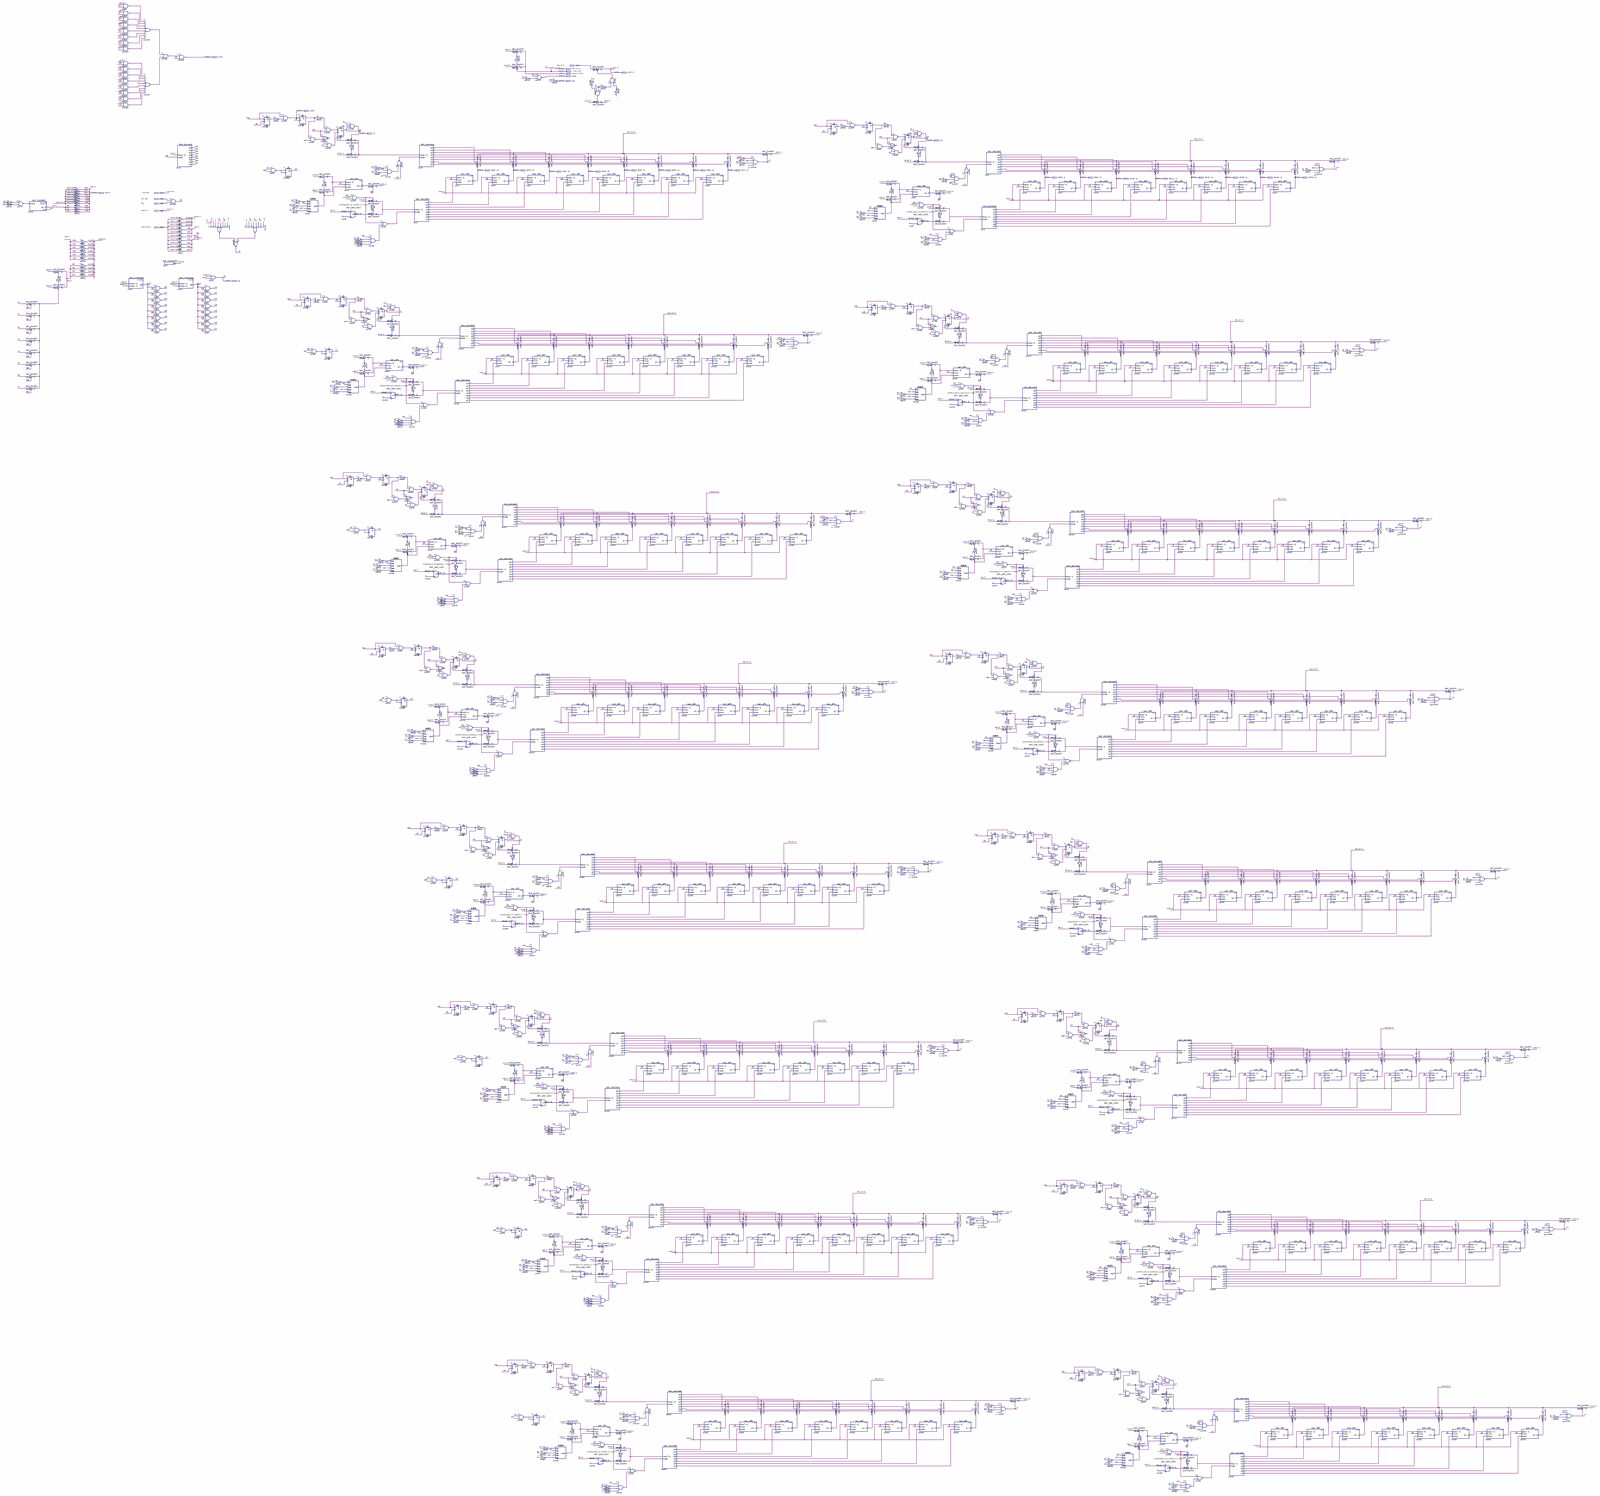
[diagram p0: schematic sheet, whole]
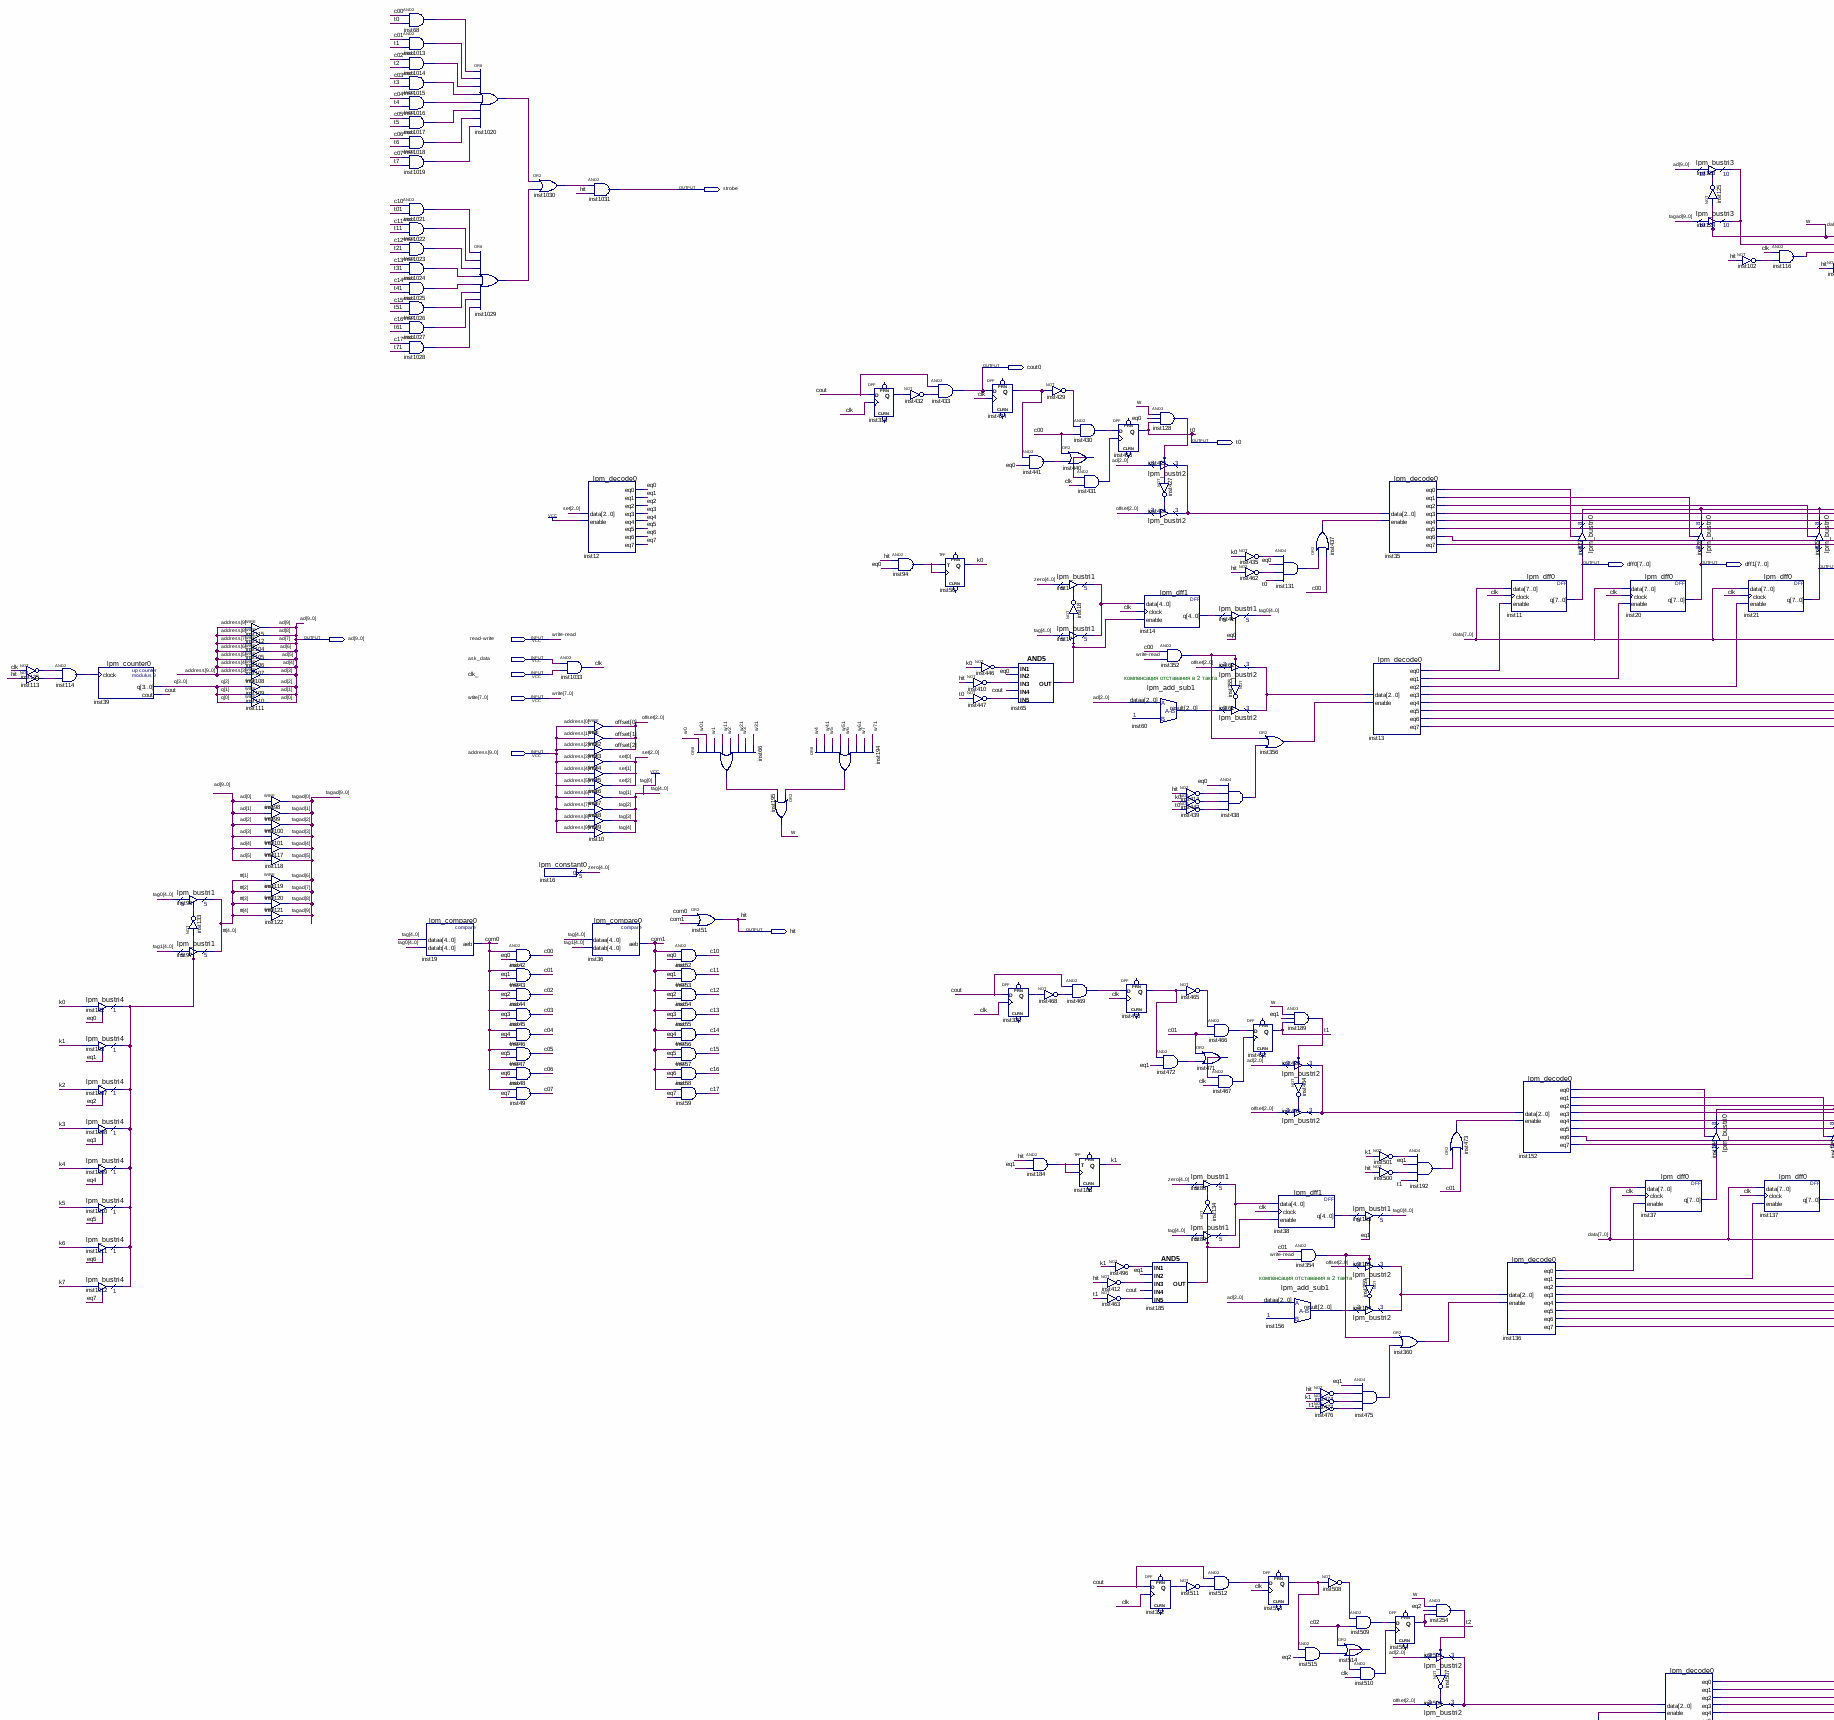
[diagram p1: schematic sheet, upper left part]
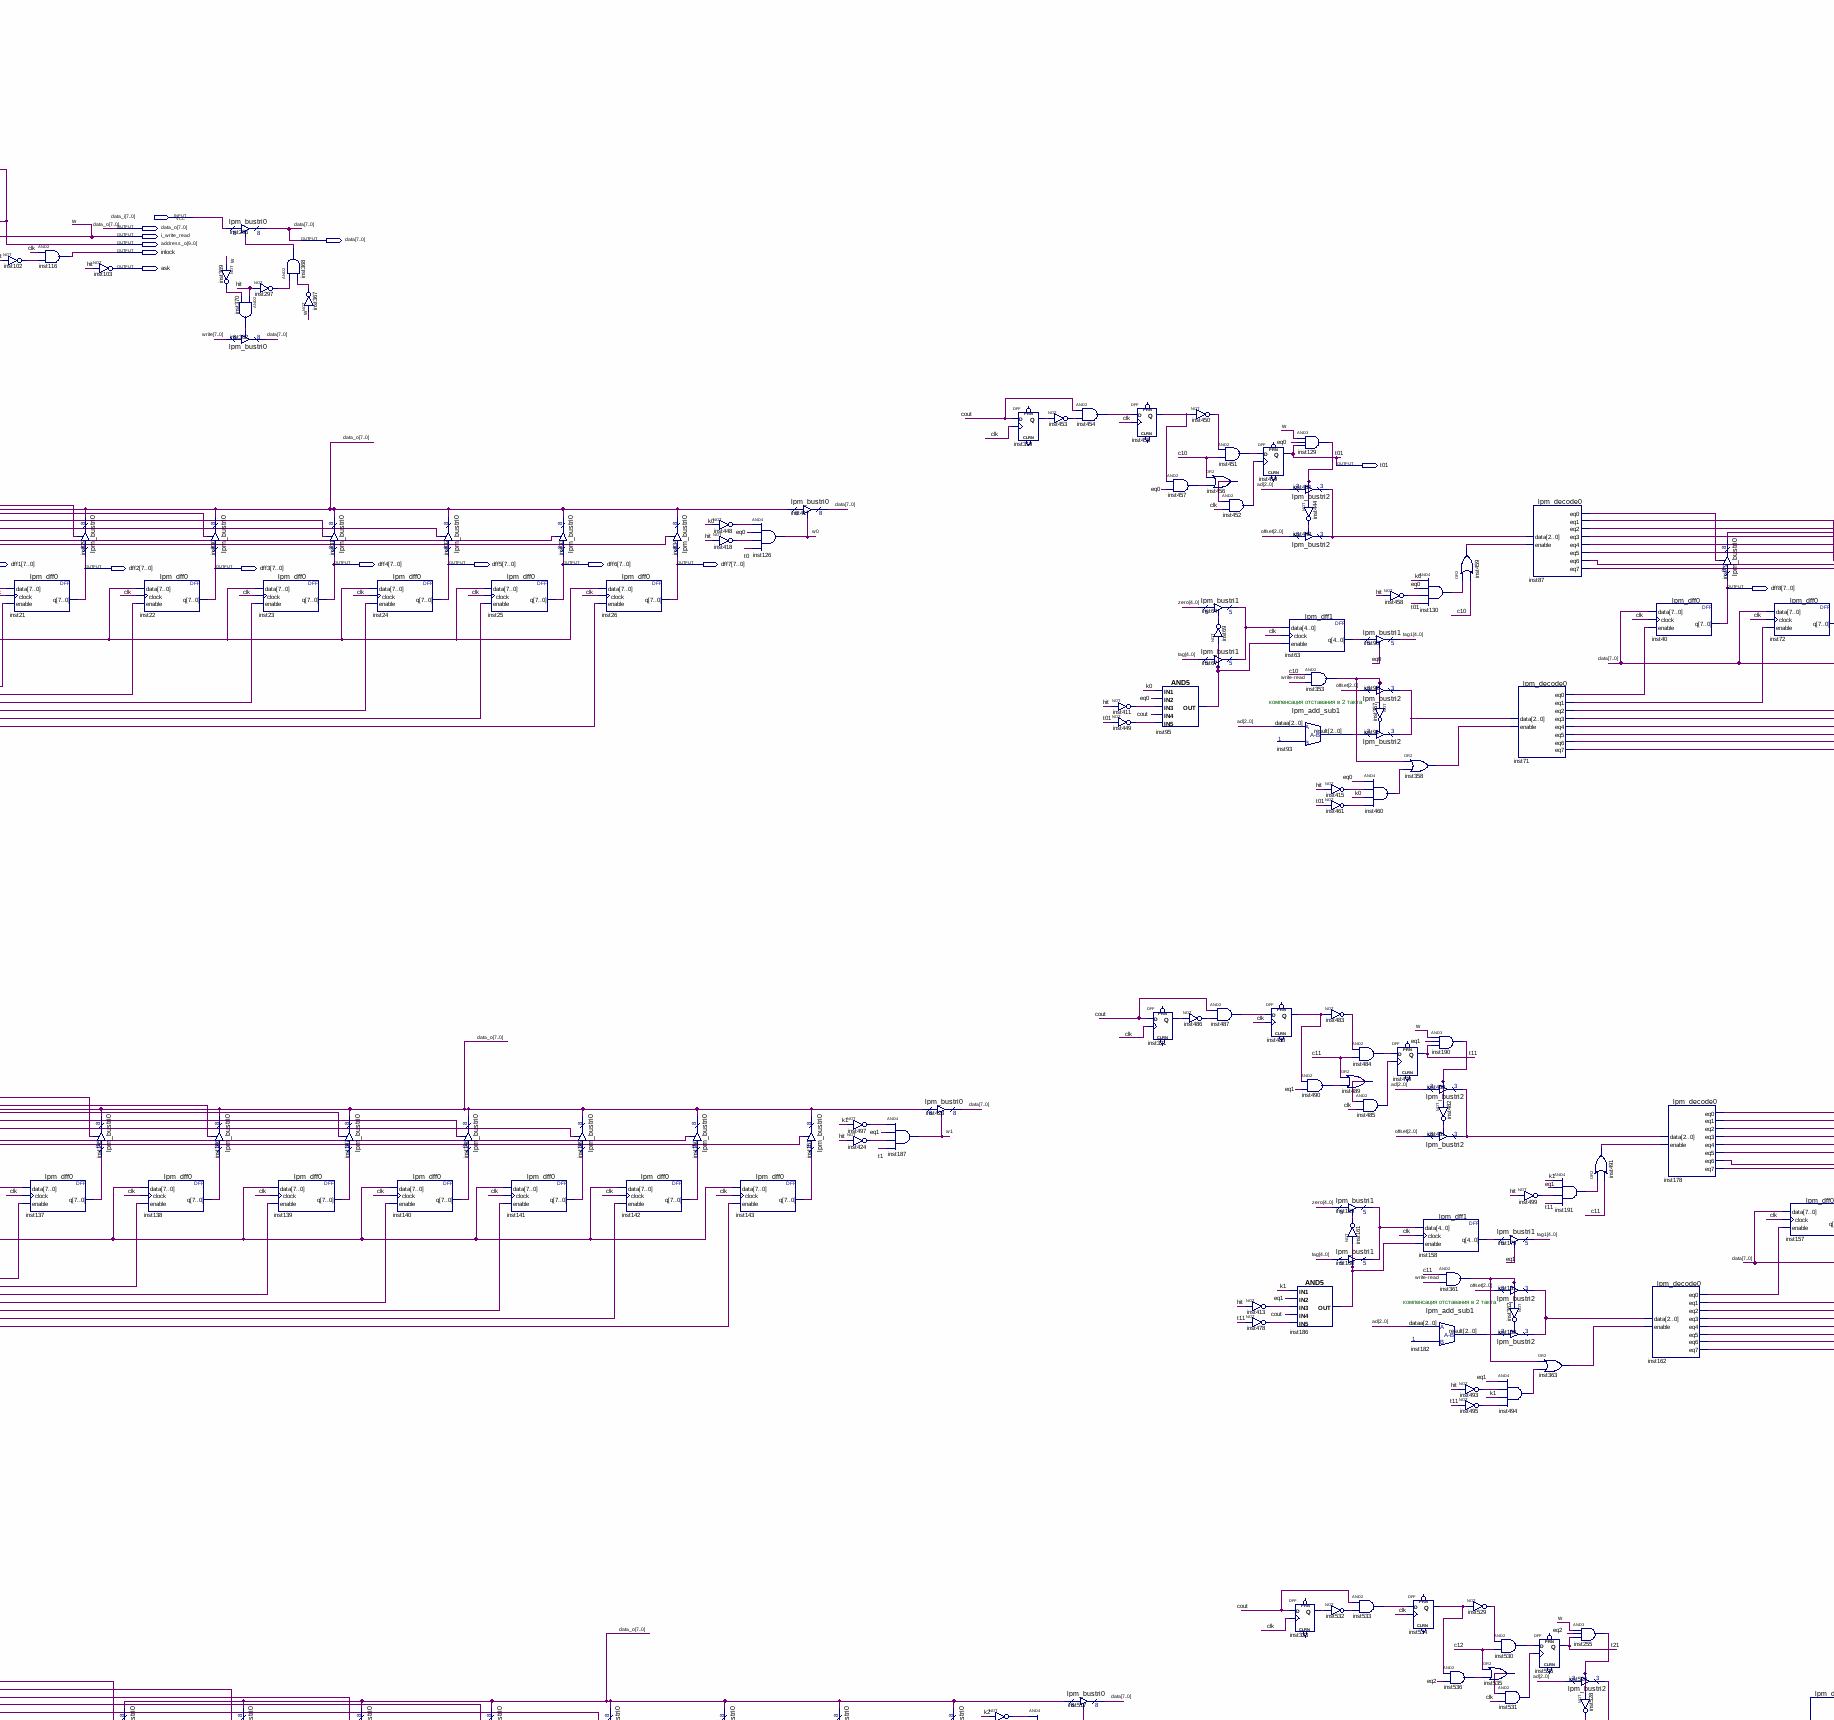
[diagram p2: schematic sheet, upper centre part]
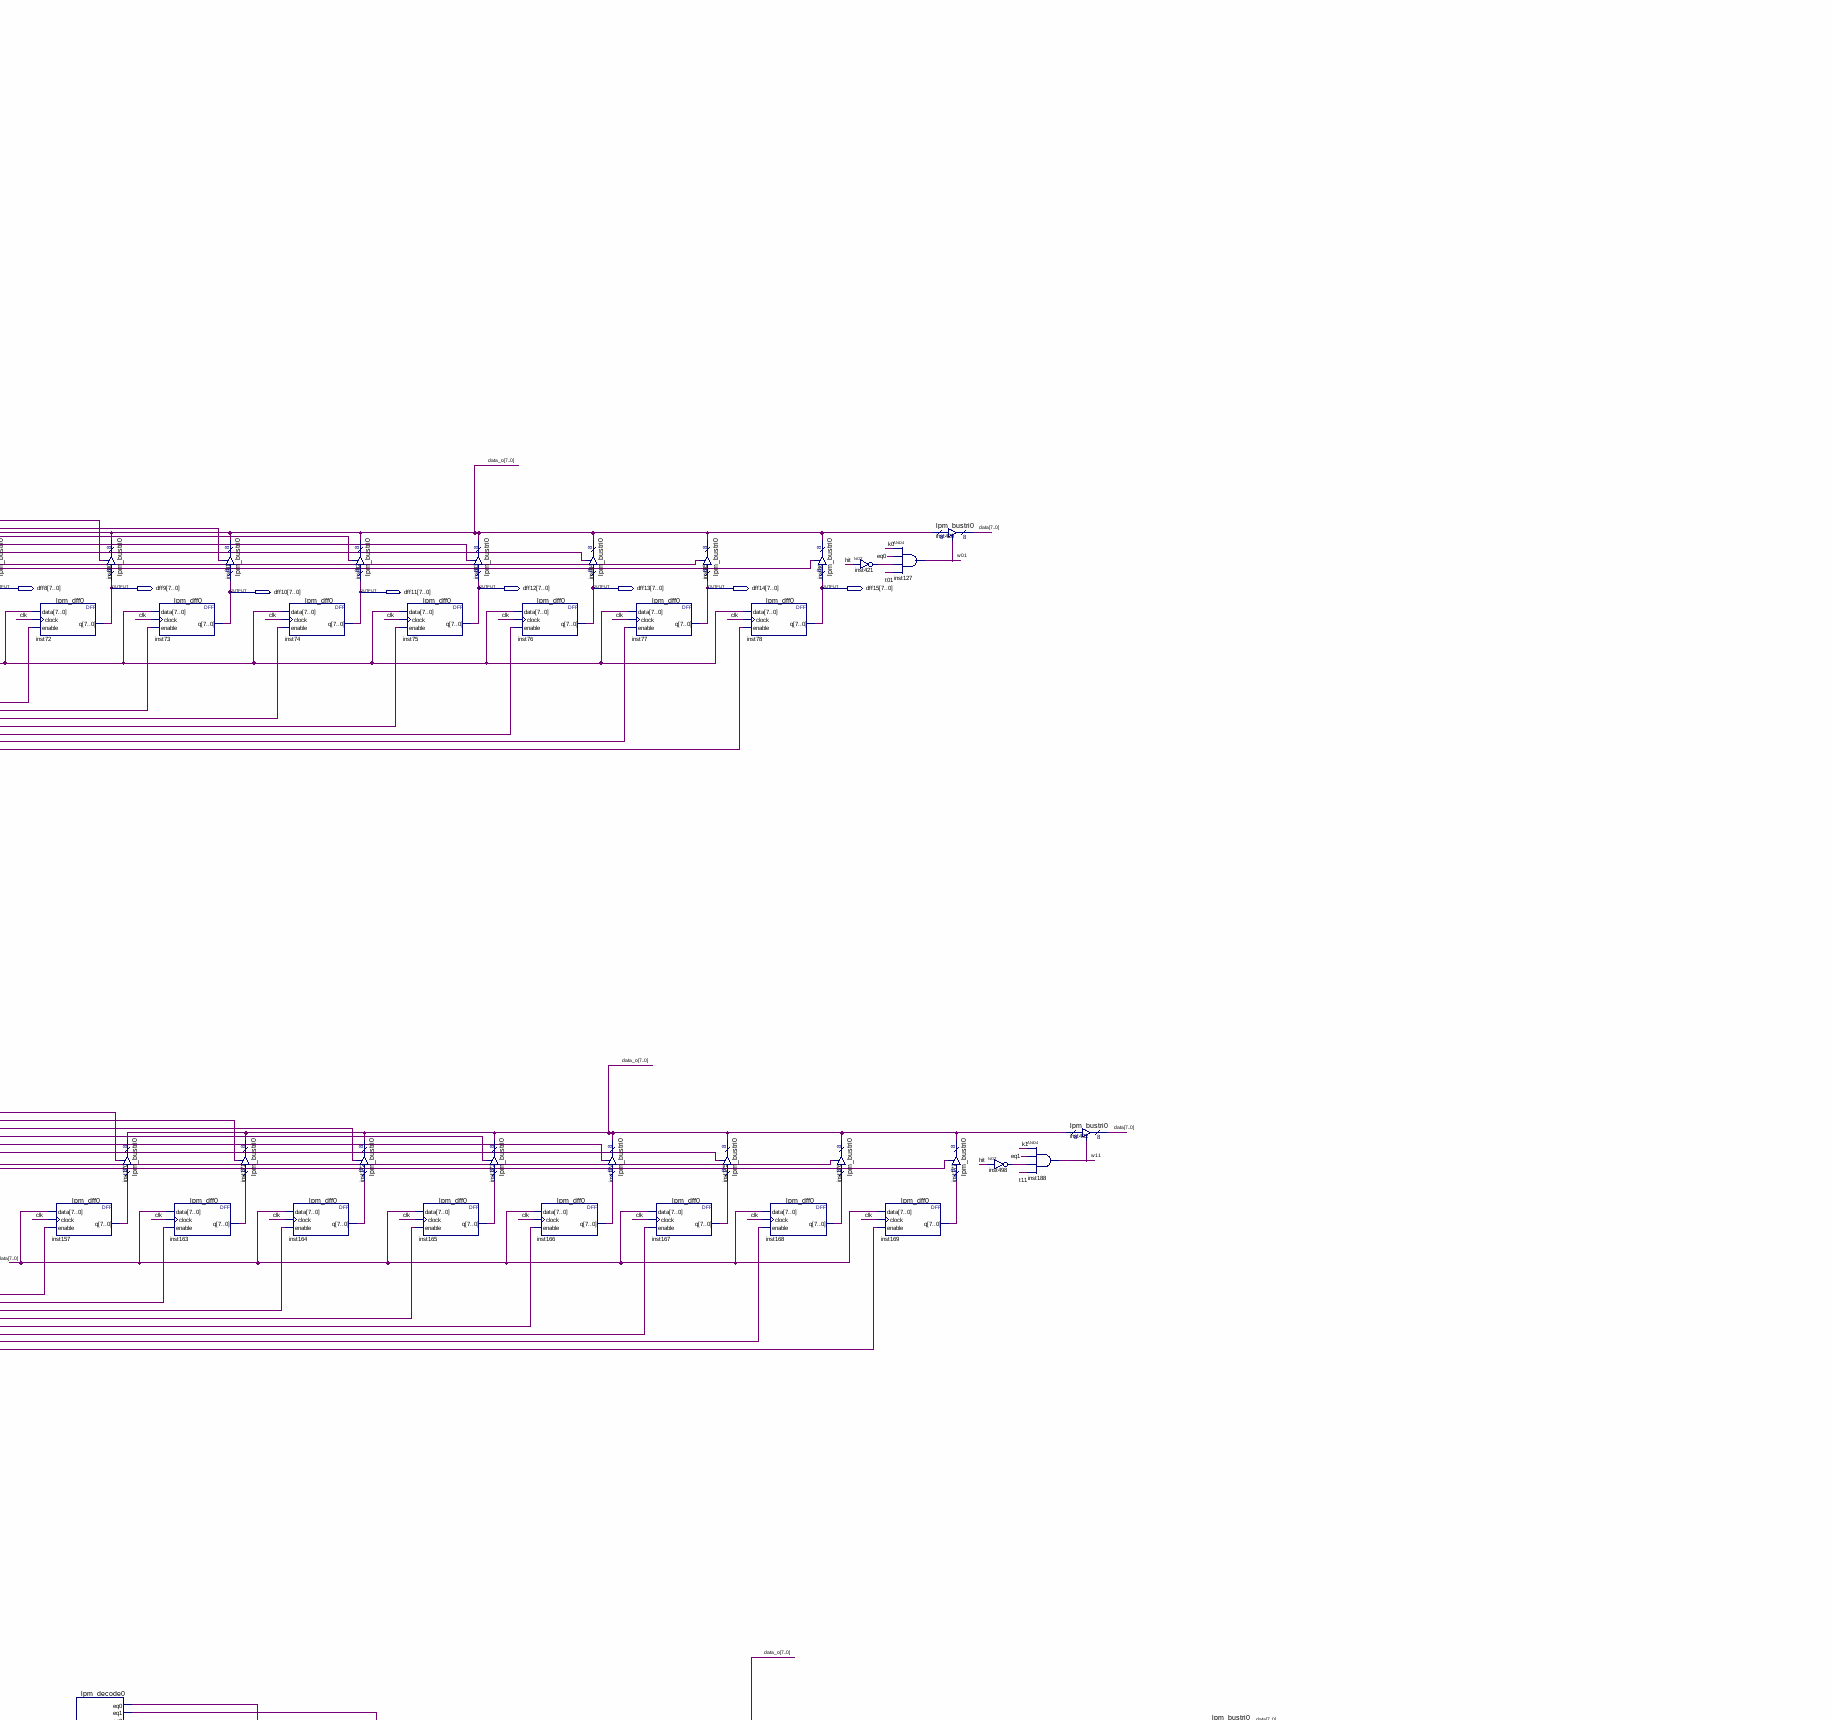
[diagram p3: schematic sheet, upper right part]
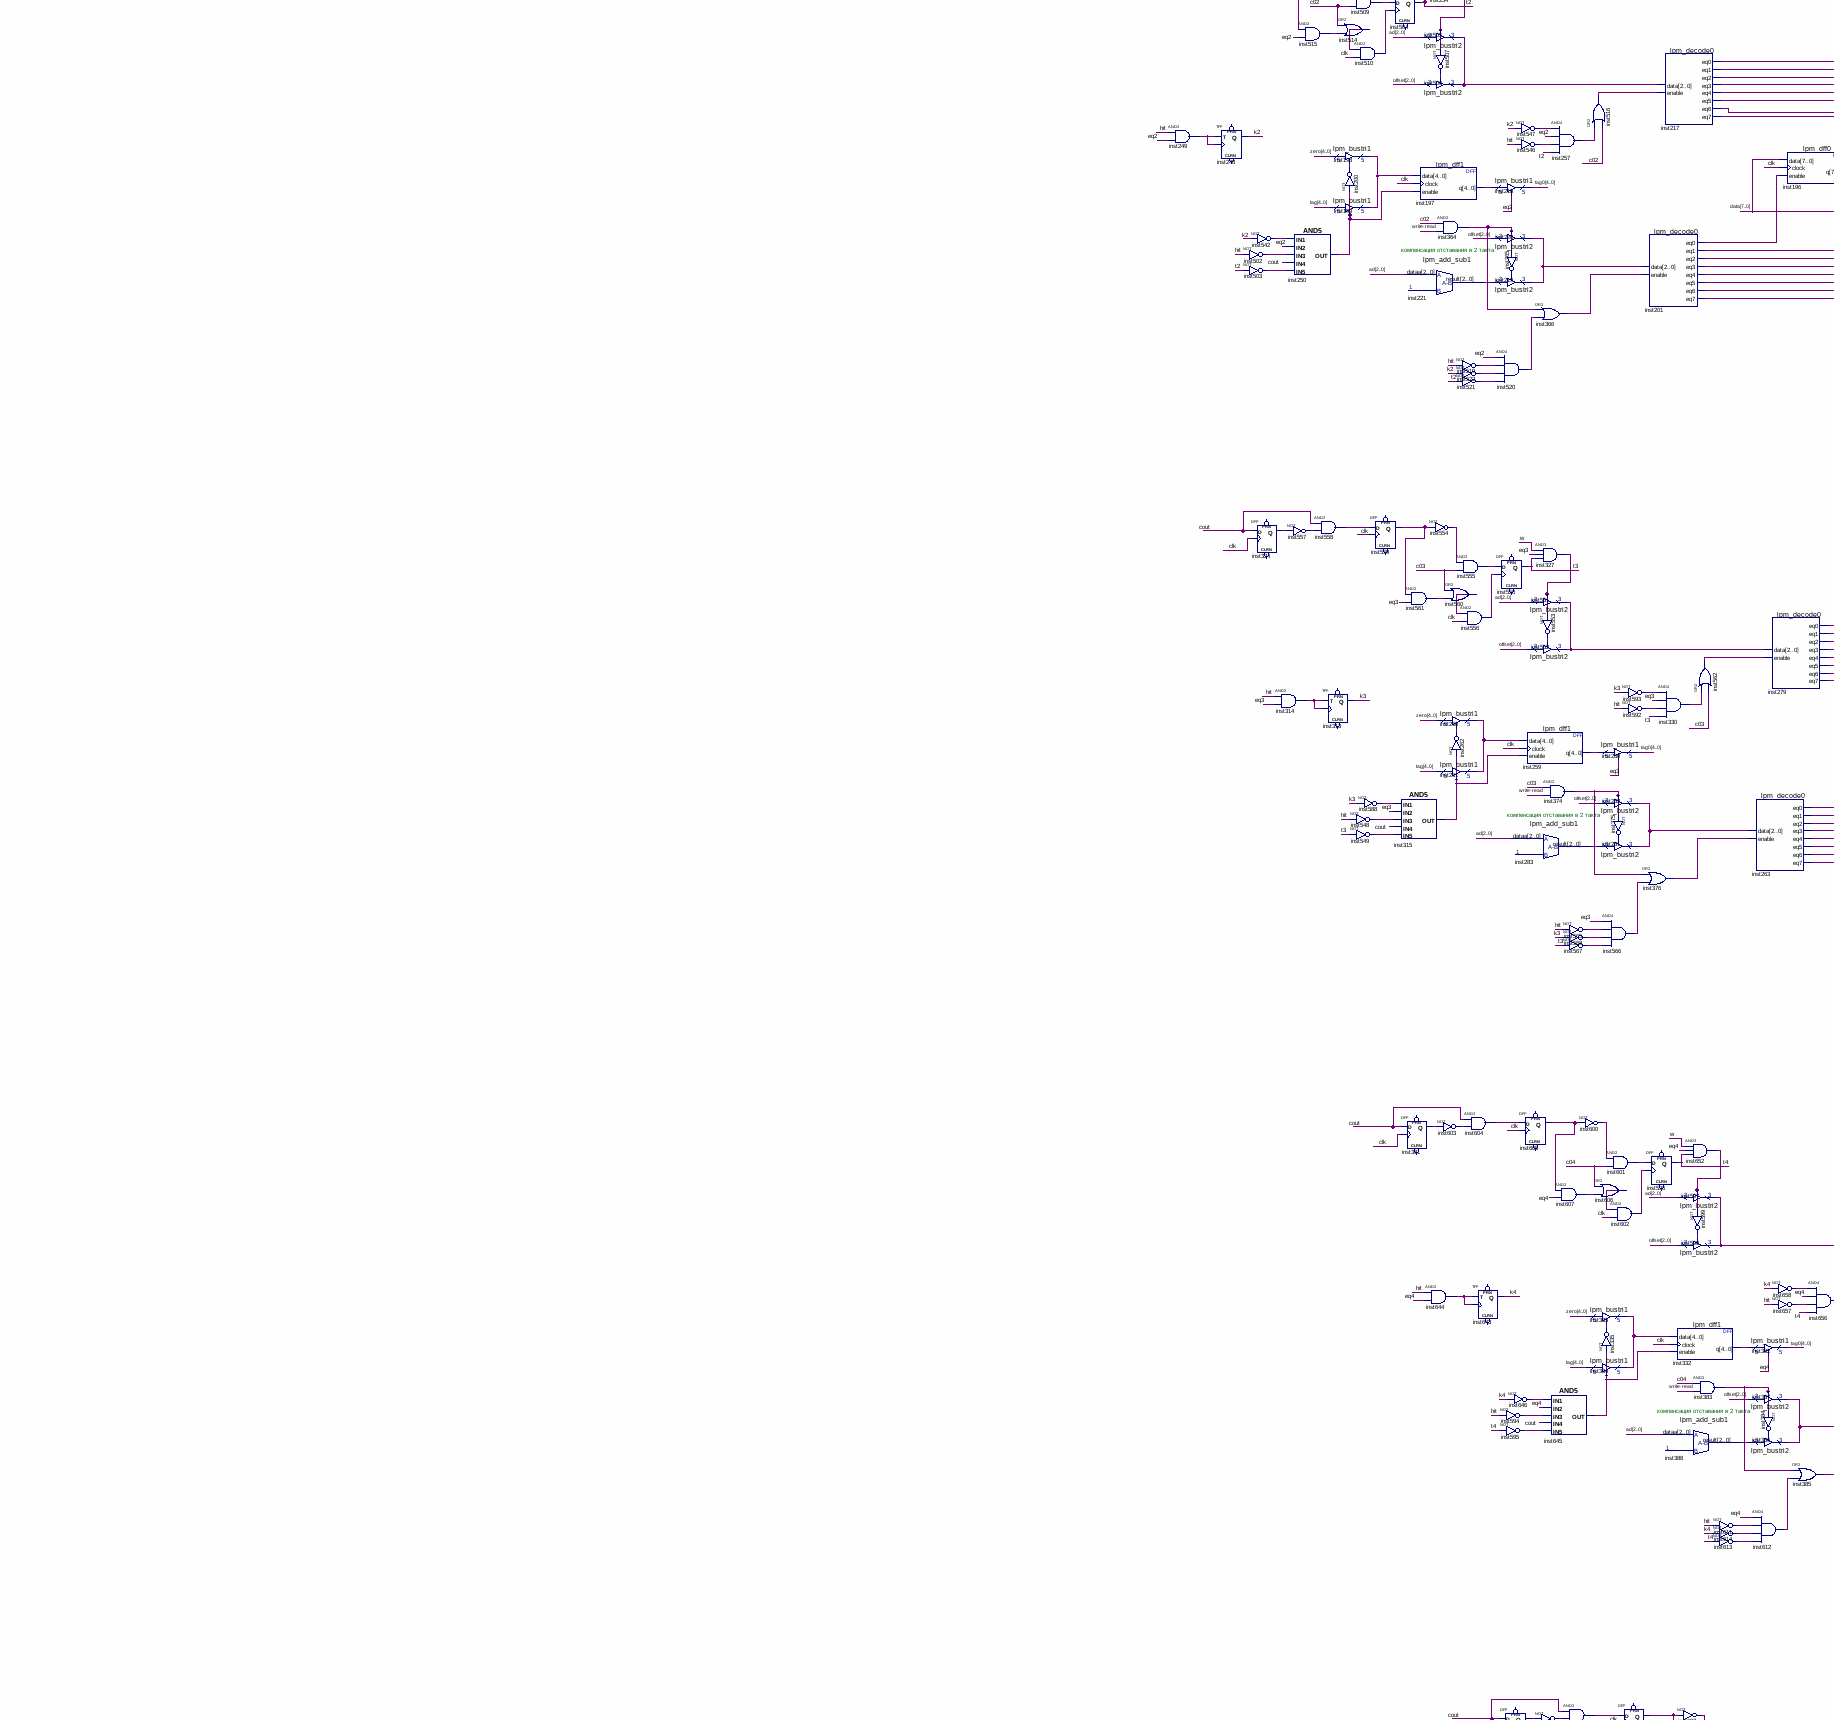
[diagram p4: schematic sheet, middle left part]
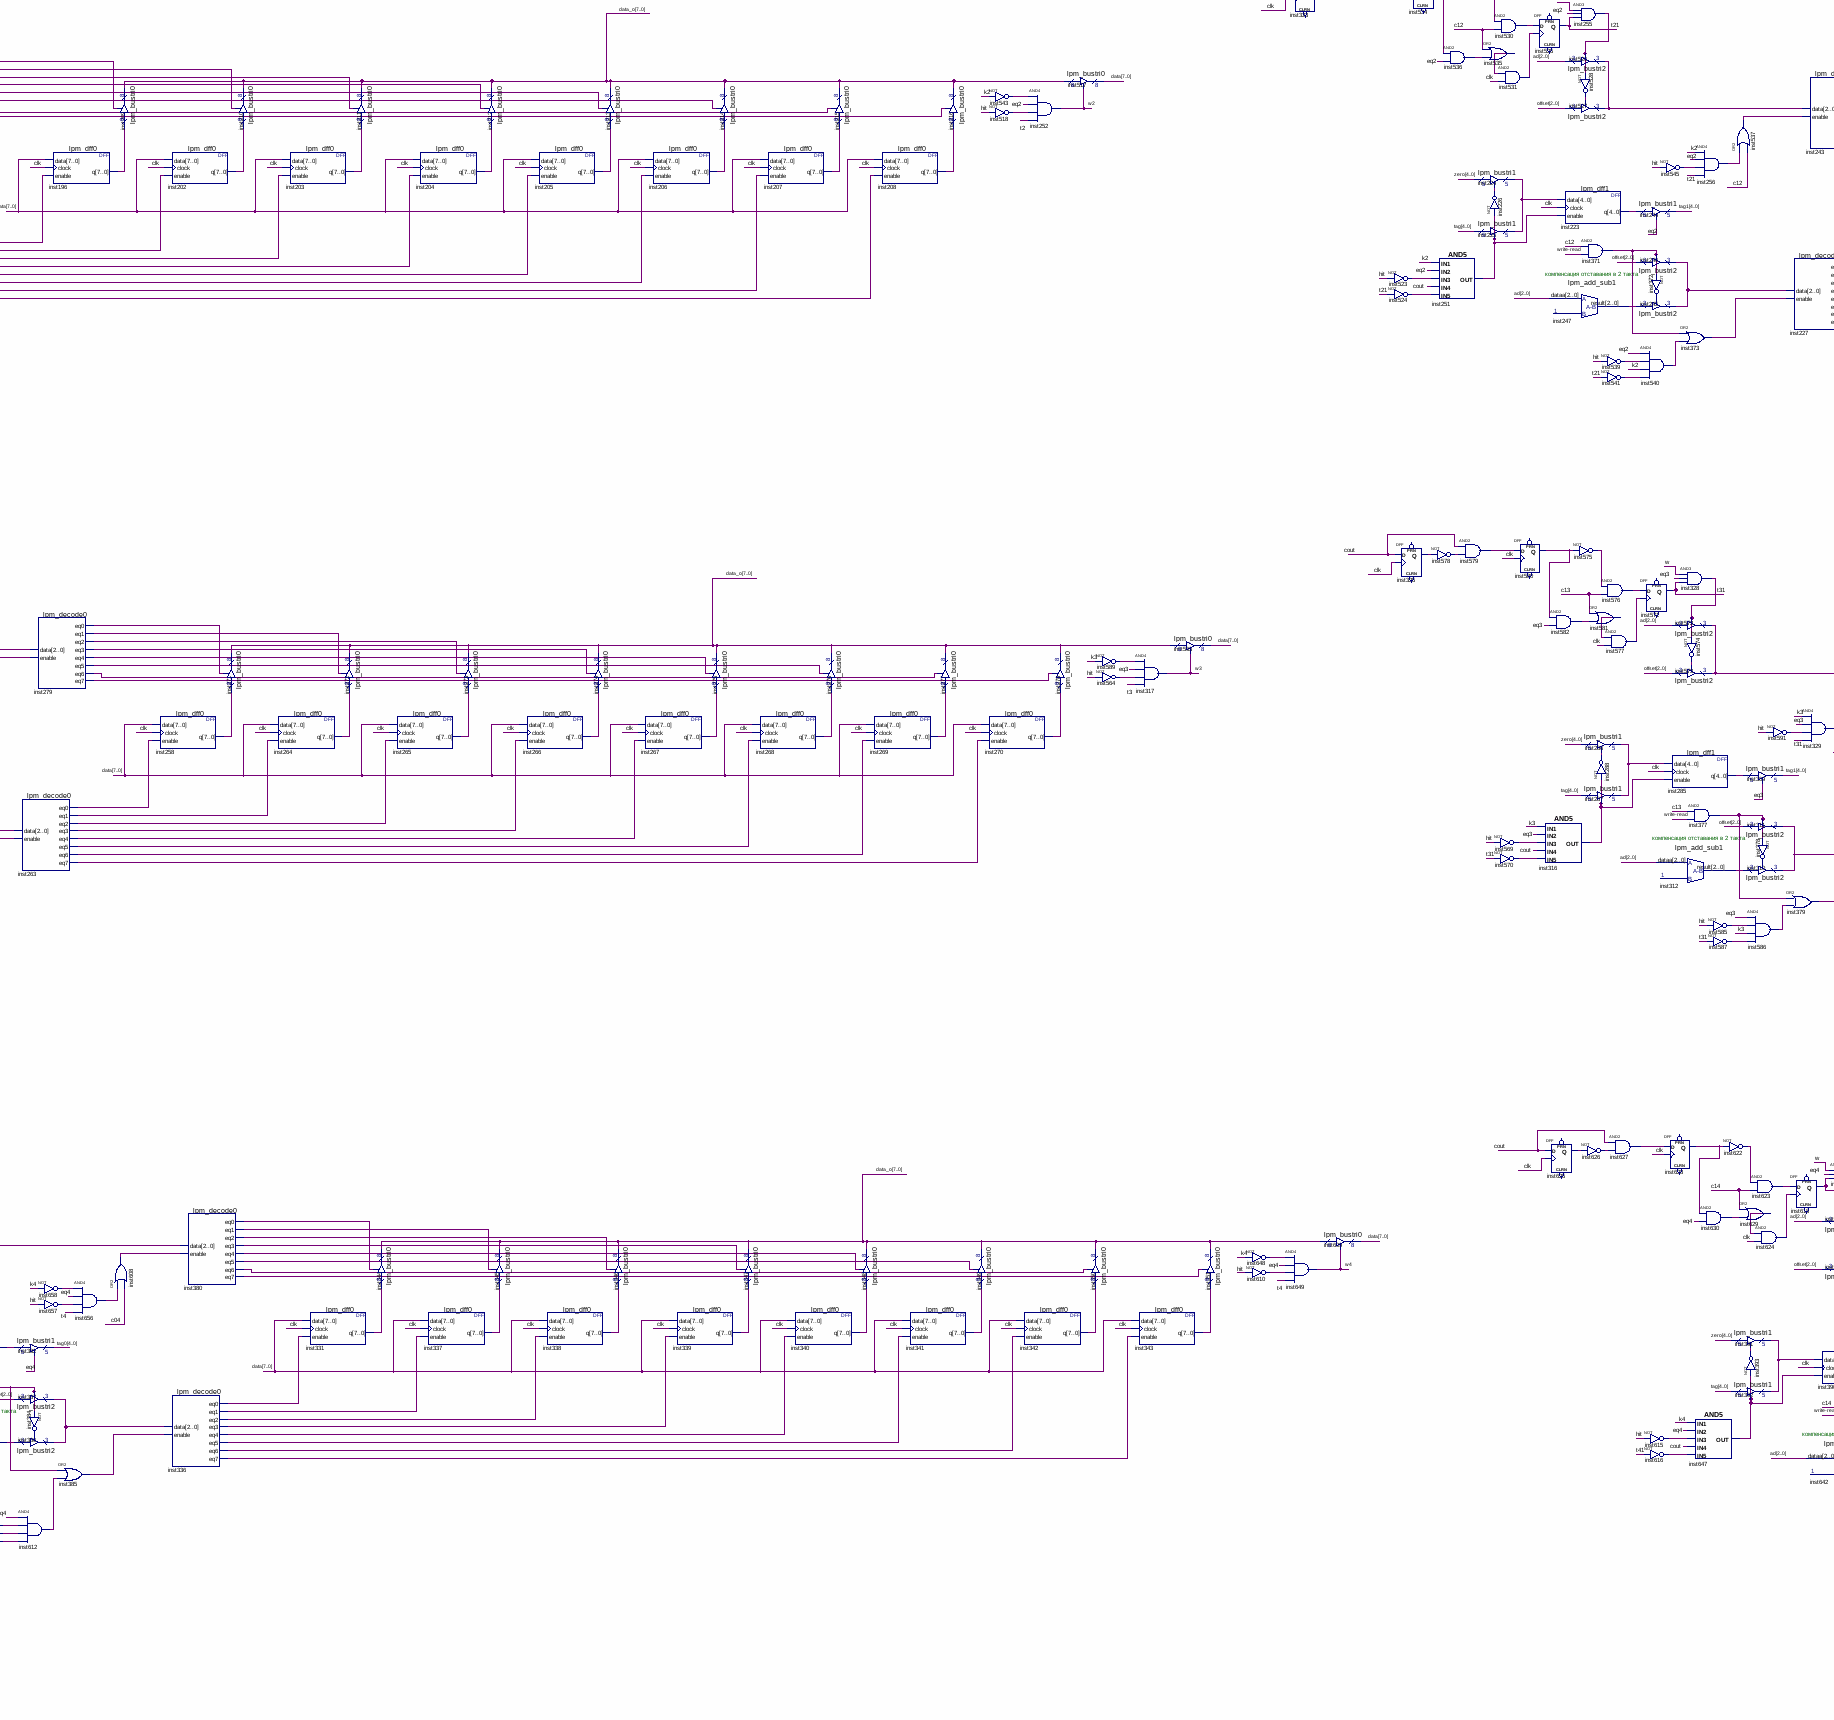
[diagram p5: schematic sheet, middle centre part]
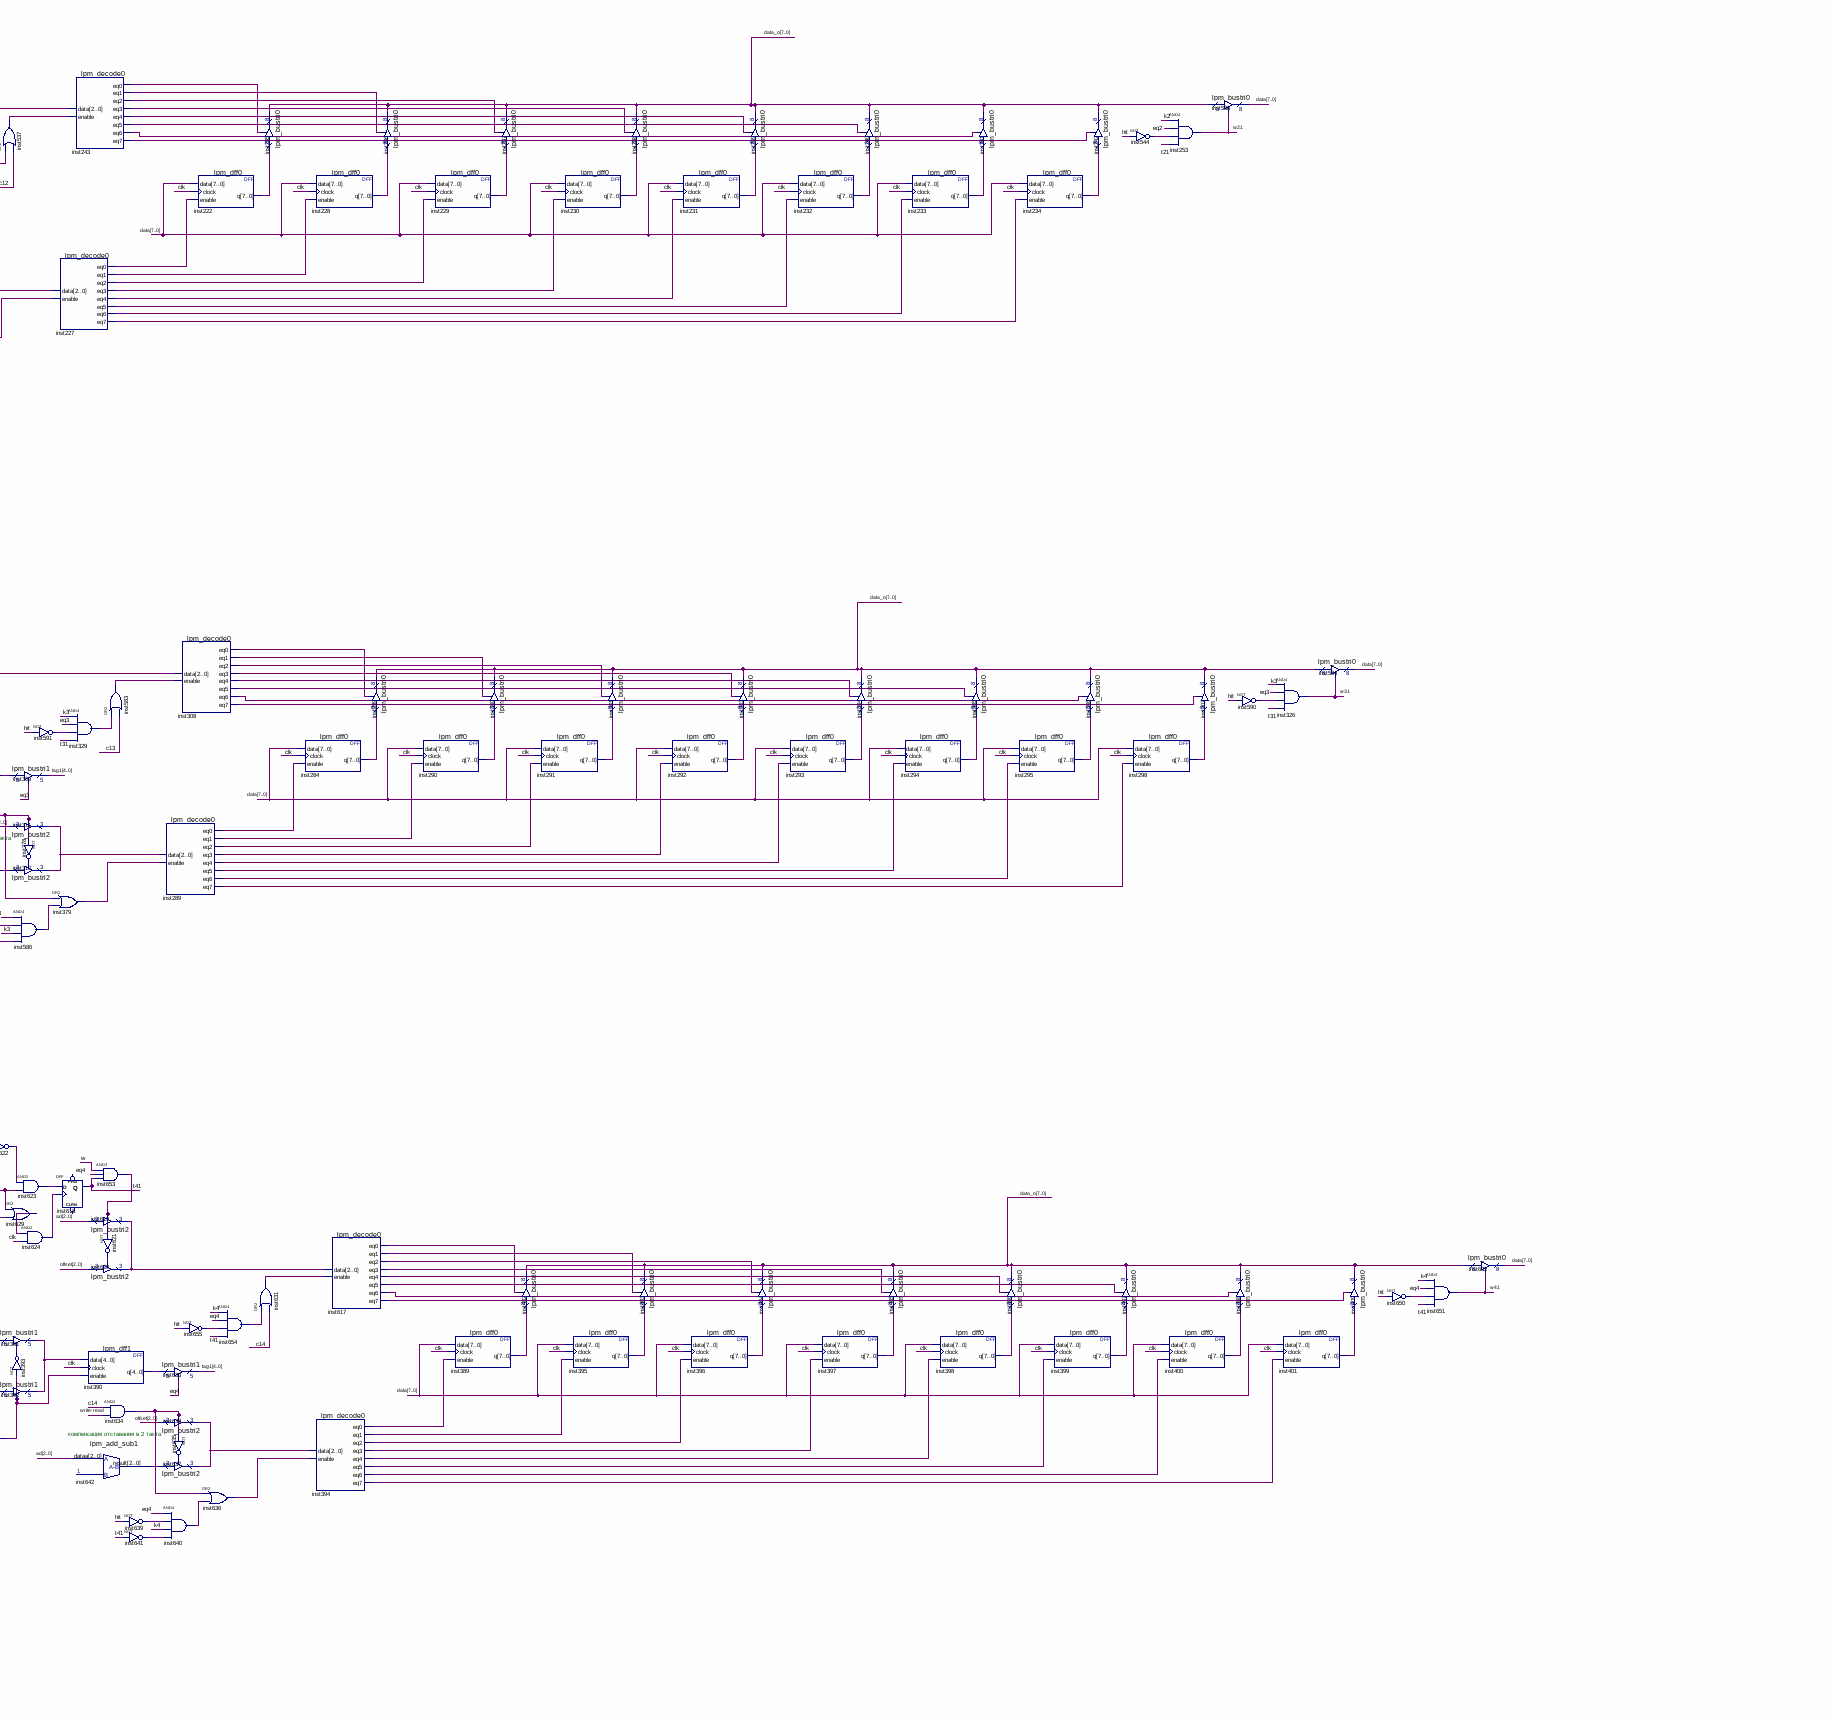
[diagram p6: schematic sheet, middle right part]
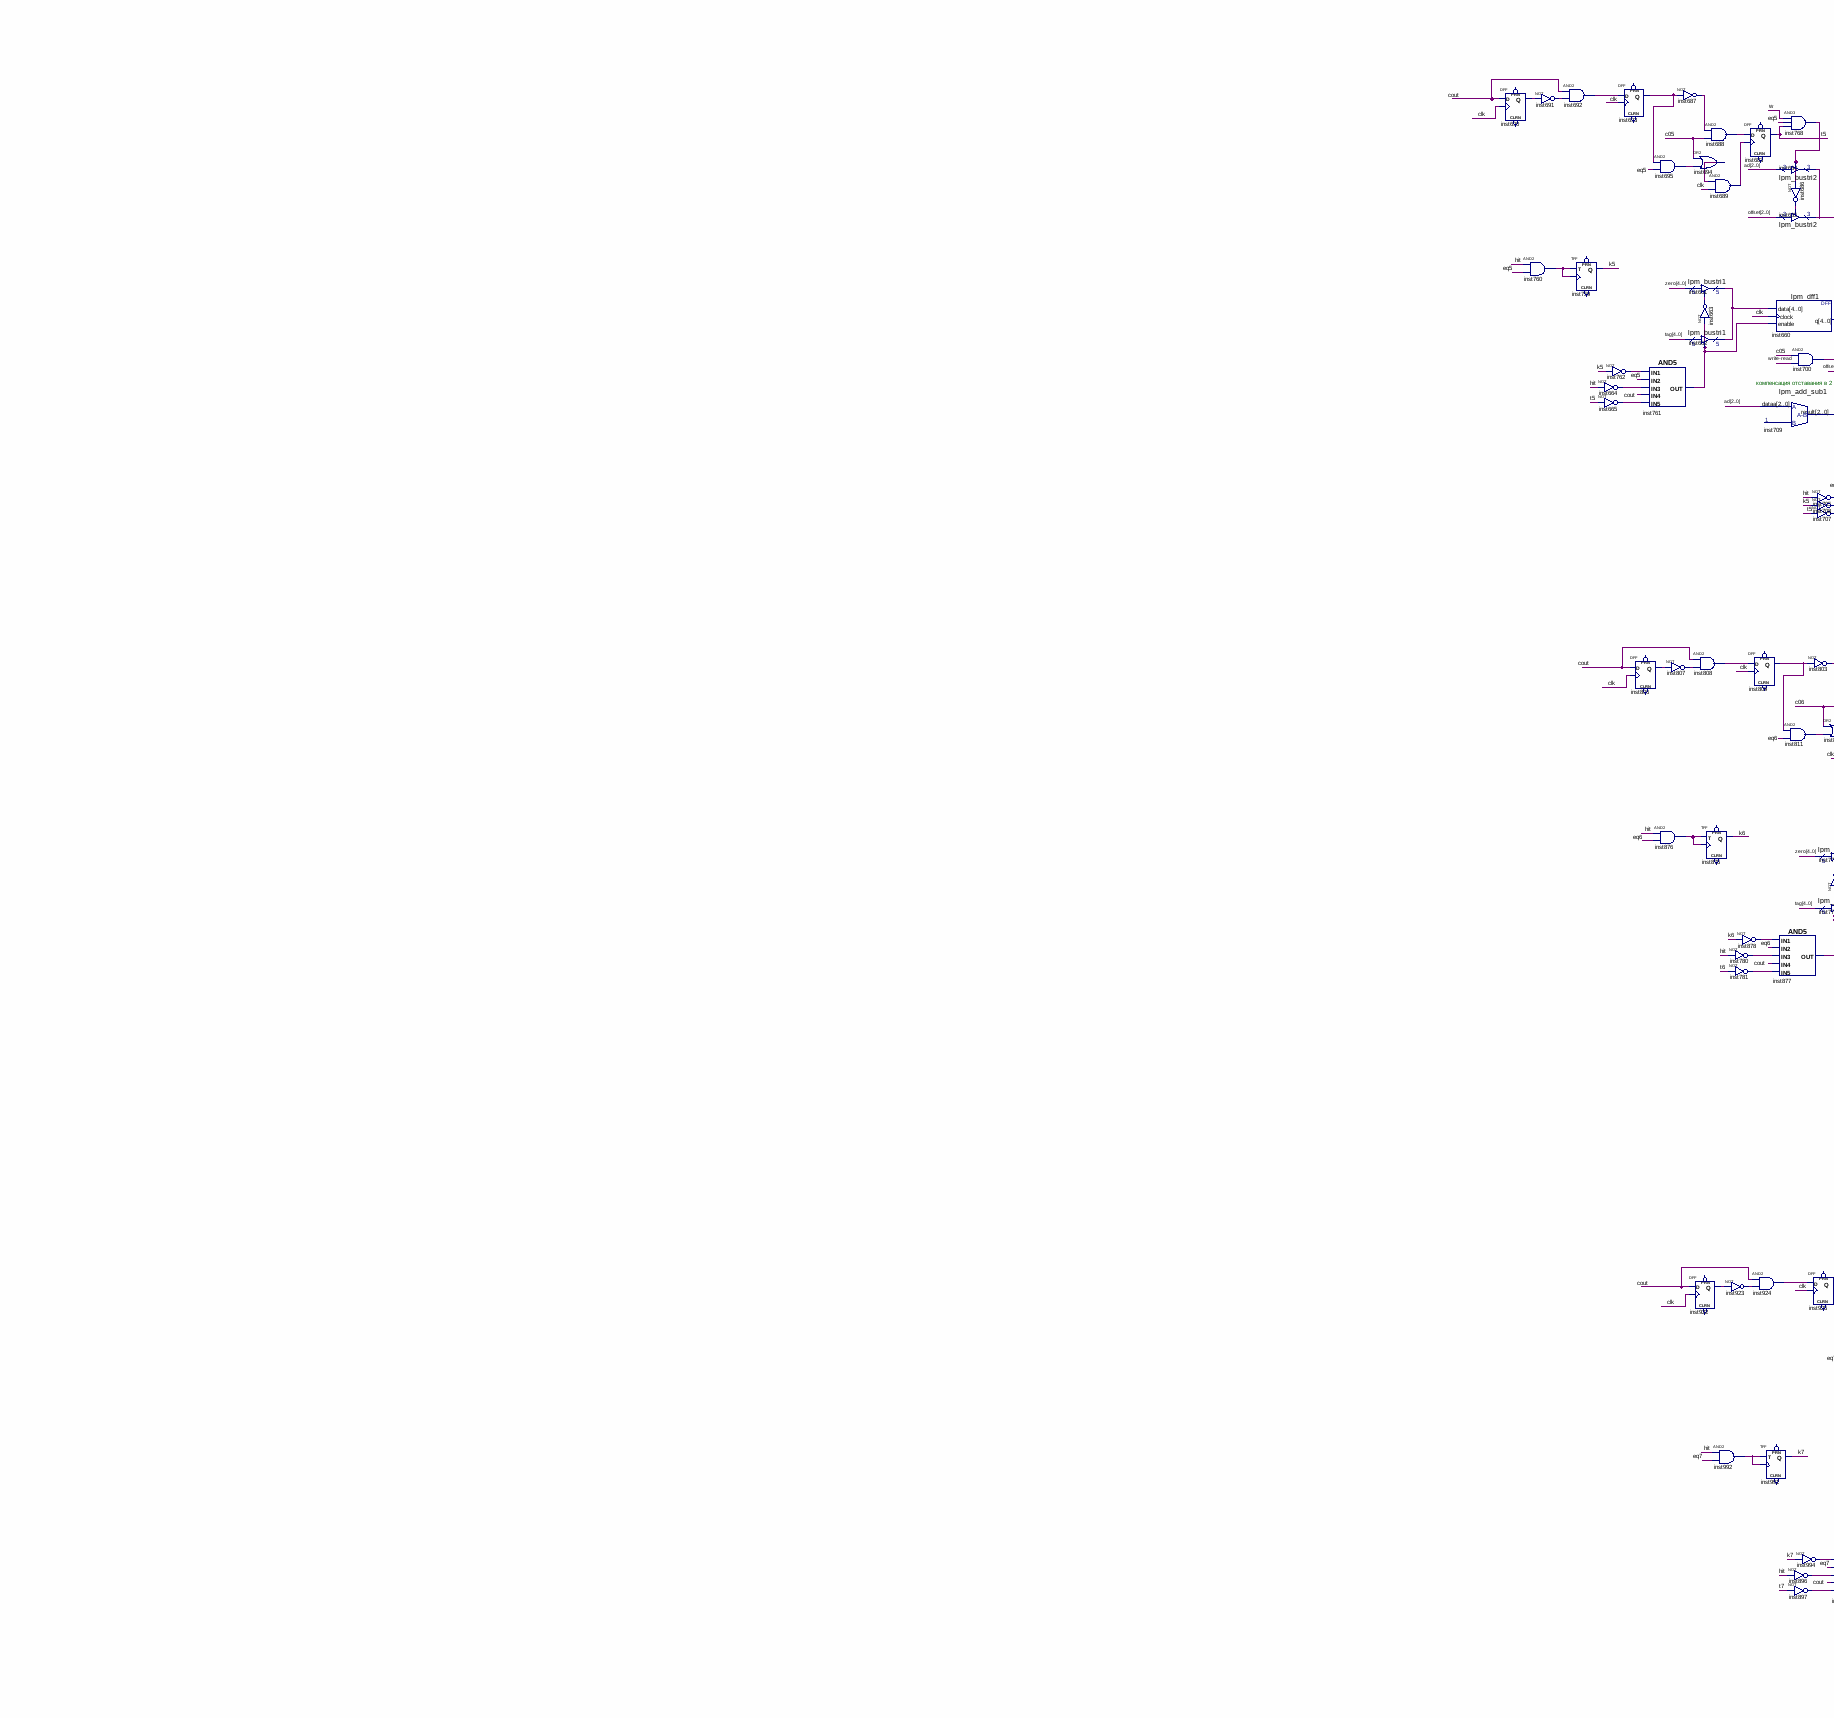
[diagram p7: schematic sheet, lower left part]
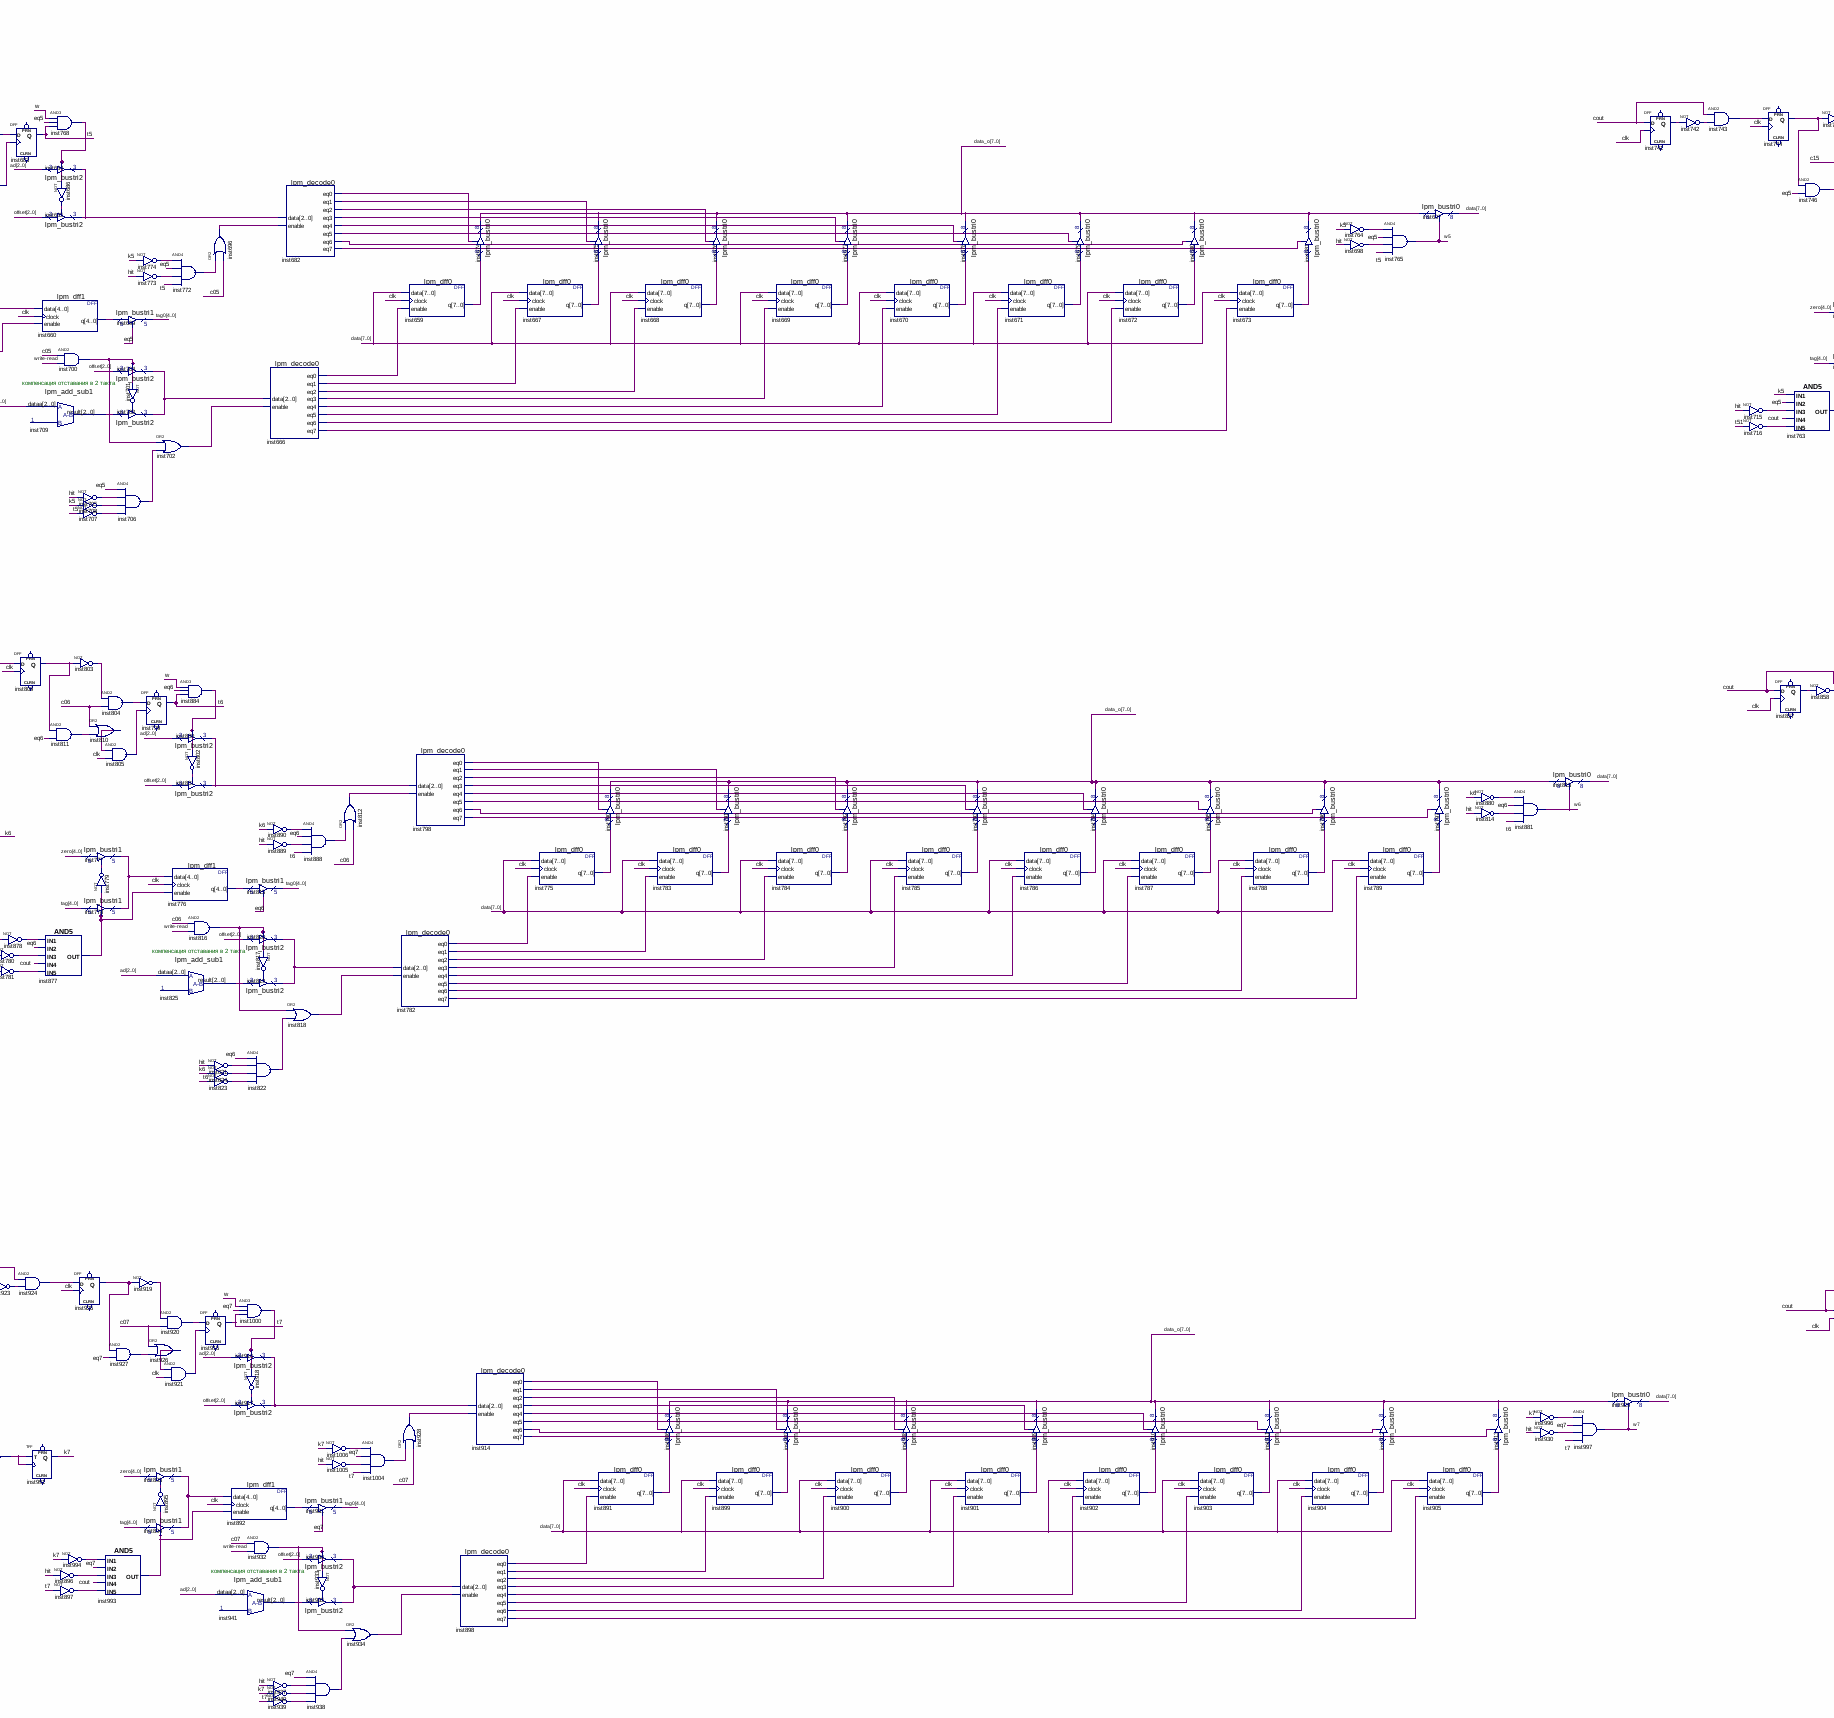
[diagram p8: schematic sheet, lower centre part]
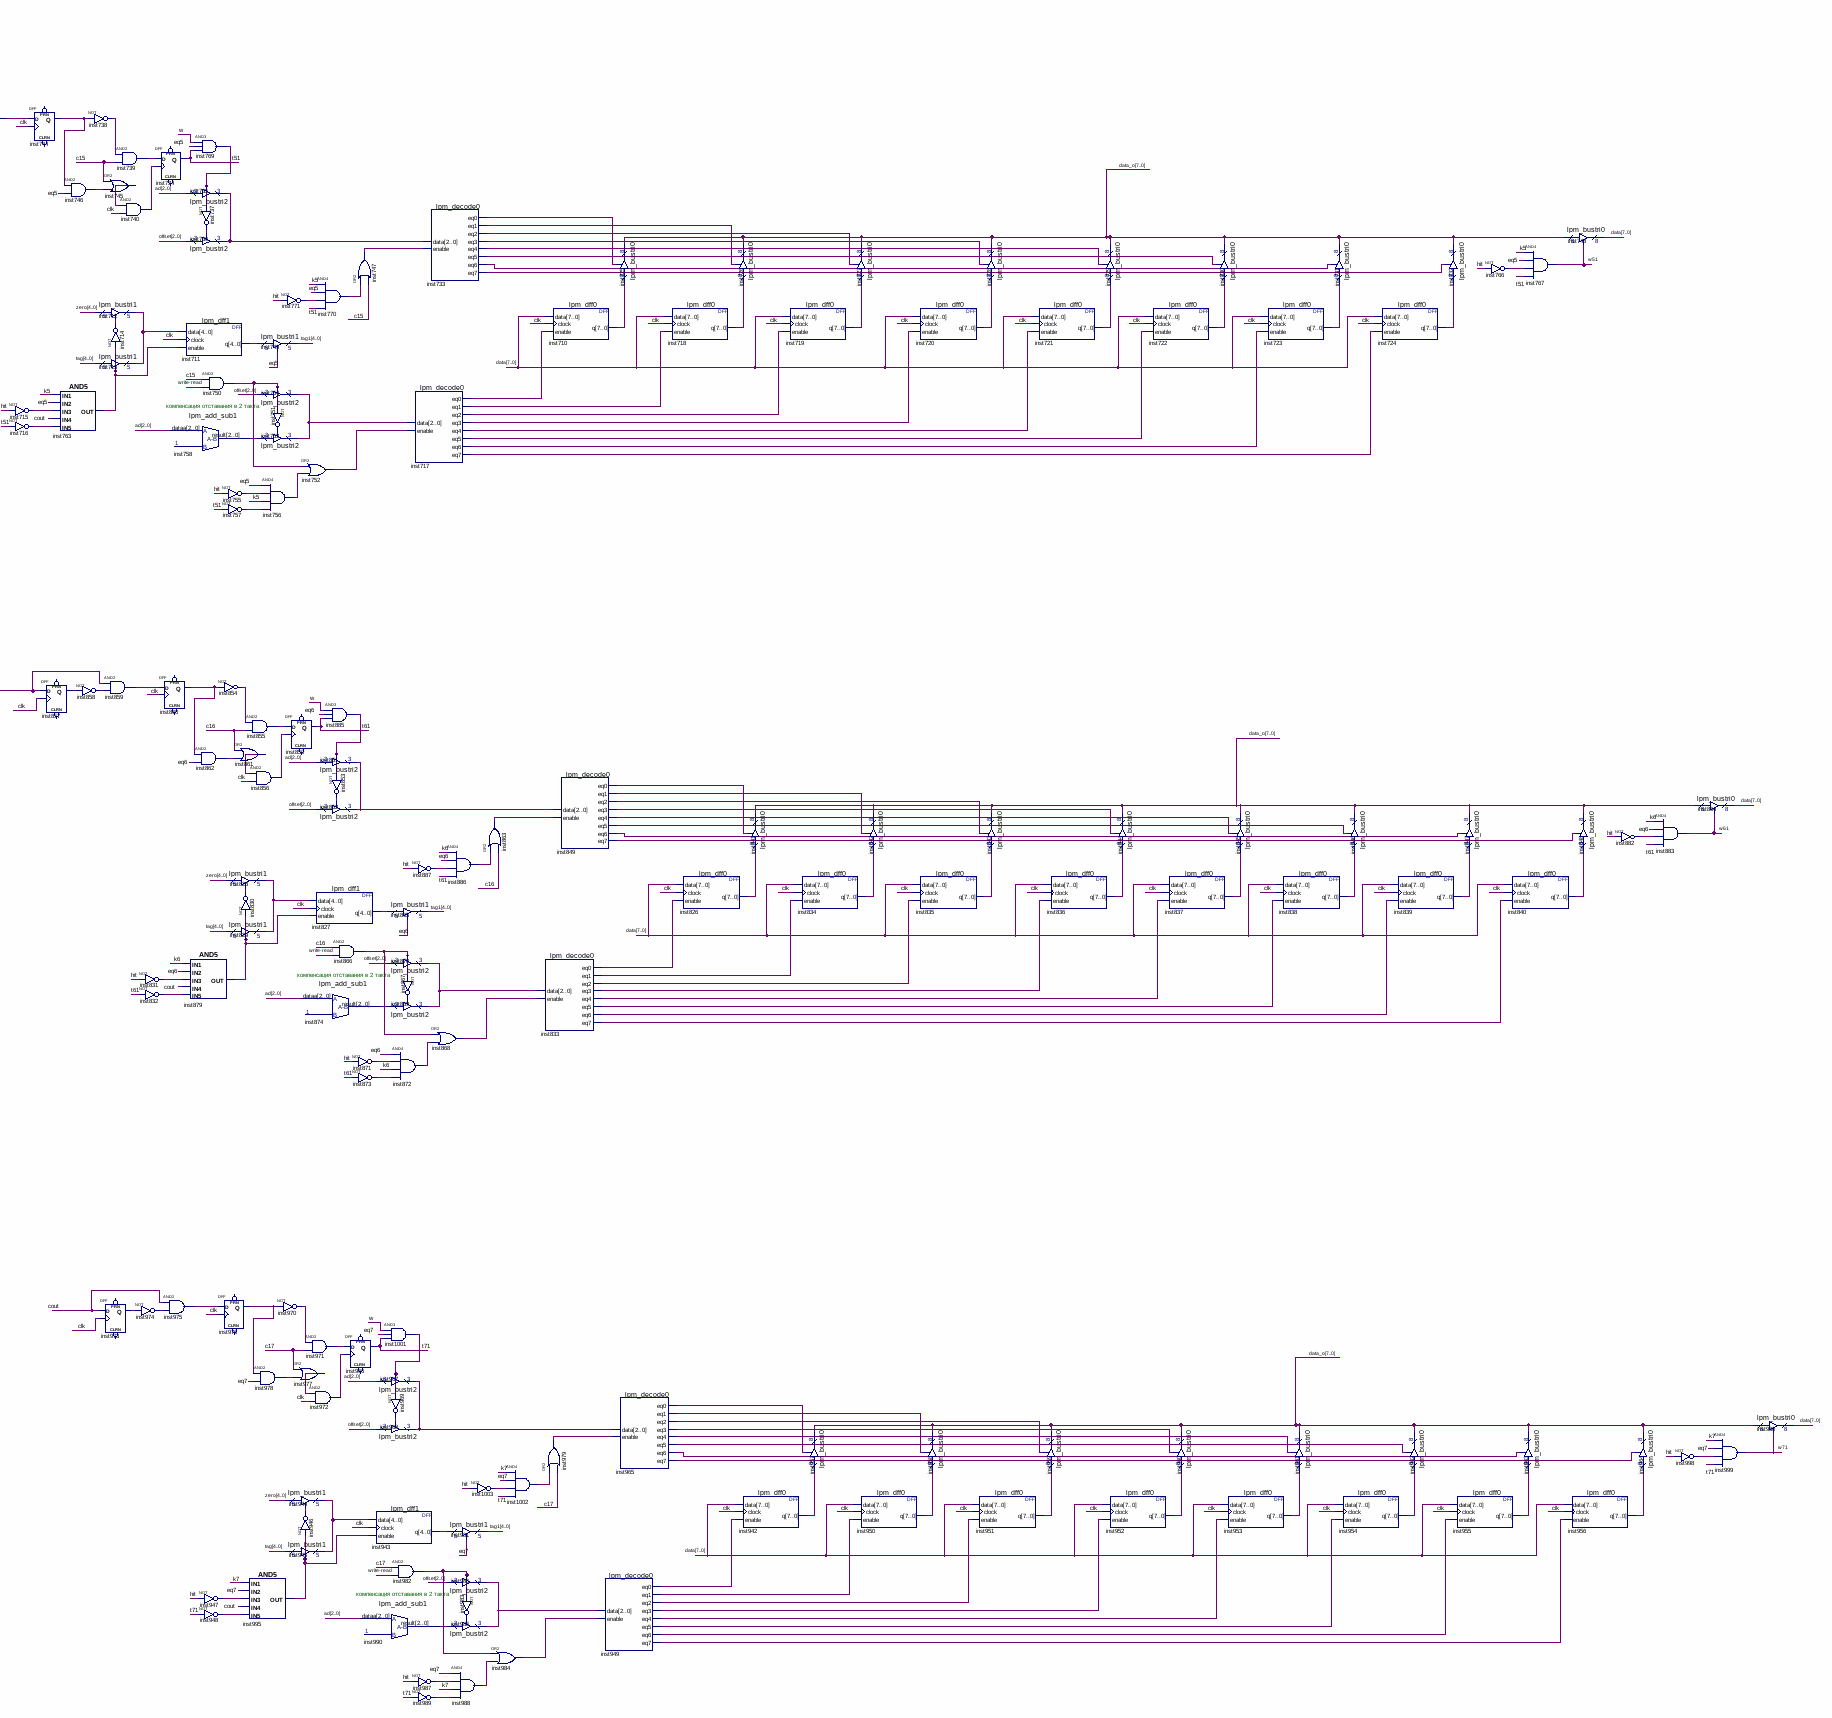
[diagram p9: schematic sheet, lower right part]
// Quartus schematic cash.bdf as structural Verilog: 1031 symbols, 34 pins
module cash (
  input  [7:0] data_i,
  input  \read-write ,
  input  ask_data,
  input  clk_,
  input  [7:0] wtite,
  input  [9:0] address,
  output strobe,
  output [7:0] data_o,
  output i_write_read,
  output [7:0] data,
  output [9:0] address_o,
  output inlock,
  output ask,
  output cout0,
  output t0,
  output t01,
  output [7:0] dff0,
  output [7:0] dff1,
  output [7:0] dff4,
  output [7:0] dff5,
  output [7:0] dff6,
  output [7:0] dff7,
  output [7:0] dff2,
  output [7:0] dff3,
  output [7:0] dff8,
  output [7:0] dff9,
  output [7:0] dff12,
  output [7:0] dff13,
  output [7:0] dff14,
  output [7:0] dff15,
  output [7:0] dff10,
  output [7:0] dff11,
  output [9:0] ad,
  output hit
);

  wire c00, c01, c02, c03, c04, c05, c06, c07, c10, c11, c12, c13, c14, c15, c16, c17, clk, com0, com1, cout,
       eq0, eq1, eq2, eq3, eq4, eq5, eq6, eq7, inst13_eq0, inst13_eq1, inst13_eq2, inst13_eq3, inst13_eq4,
       inst13_eq5, inst13_eq6, inst13_eq7, inst18_out, inst35_eq0, inst35_eq1, inst35_eq2, inst35_eq3,
       inst35_eq4, inst35_eq5, inst35_eq6, inst35_eq7, inst65_out, inst66_out, inst68_out, inst69_out,
       inst71_eq0, inst71_eq1, inst71_eq2, inst71_eq3, inst71_eq4, inst71_eq5, inst71_eq6, inst71_eq7,
       inst87_eq0, inst87_eq1, inst87_eq2, inst87_eq3, inst87_eq4, inst87_eq5, inst87_eq6, inst87_eq7,
       inst94_out, inst95_out, inst102_out, inst113_out, inst114_out, inst125_out, inst128_out, inst129_out,
       inst130_out, inst131_out, inst132_tridata, inst133_out, inst134_out, inst135_out, inst136_eq0,
       inst136_eq1, inst136_eq2, inst136_eq3, inst136_eq4, inst136_eq5, inst136_eq6, inst136_eq7,
       inst152_eq0, inst152_eq1, inst152_eq2, inst152_eq3, inst152_eq4, inst152_eq5, inst152_eq6,
       inst152_eq7, inst161_out, inst162_eq0, inst162_eq1, inst162_eq2, inst162_eq3, inst162_eq4,
       inst162_eq5, inst162_eq6, inst162_eq7, inst178_eq0, inst178_eq1, inst178_eq2, inst178_eq3,
       inst178_eq4, inst178_eq5, inst178_eq6, inst178_eq7, inst184_out, inst185_out, inst186_out,
       inst189_out, inst190_out, inst191_out, inst192_out, inst194_out, inst200_out, inst201_eq0,
       inst201_eq1, inst201_eq2, inst201_eq3, inst201_eq4, inst201_eq5, inst201_eq6, inst201_eq7,
       inst217_eq0, inst217_eq1, inst217_eq2, inst217_eq3, inst217_eq4, inst217_eq5, inst217_eq6,
       inst217_eq7, inst226_out, inst227_eq0, inst227_eq1, inst227_eq2, inst227_eq3, inst227_eq4,
       inst227_eq5, inst227_eq6, inst227_eq7, inst243_eq0, inst243_eq1, inst243_eq2, inst243_eq3,
       inst243_eq4, inst243_eq5, inst243_eq6, inst243_eq7, inst249_out, inst250_out, inst251_out,
       inst254_out, inst255_out, inst256_out, inst257_out, inst262_out, inst263_eq0, inst263_eq1,
       inst263_eq2, inst263_eq3, inst263_eq4, inst263_eq5, inst263_eq6, inst263_eq7, inst279_eq0,
       inst279_eq1, inst279_eq2, inst279_eq3, inst279_eq4, inst279_eq5, inst279_eq6, inst279_eq7,
       inst288_out, inst289_eq0, inst289_eq1, inst289_eq2, inst289_eq3, inst289_eq4, inst289_eq5,
       inst289_eq6, inst289_eq7, inst297_out, inst308_eq0, inst308_eq1, inst308_eq2, inst308_eq3,
       inst308_eq4, inst308_eq5, inst308_eq6, inst308_eq7, inst314_out, inst315_out, inst316_out, inst318_q,
       inst319_q, inst320_q, inst321_q, inst322_q, inst323_q, inst324_q, inst325_q, inst327_out, inst328_out,
       inst329_out, inst330_out, inst335_out, inst336_eq0, inst336_eq1, inst336_eq2, inst336_eq3,
       inst336_eq4, inst336_eq5, inst336_eq6, inst336_eq7, inst352_out, inst353_out, inst354_out,
       inst355_out, inst356_out, inst357_out, inst358_out, inst359_out, inst360_out, inst361_out,
       inst362_out, inst363_out, inst364_out, inst365_out, inst366_out, inst367_out, inst368_out,
       inst369_out, inst370_out, inst371_out, inst372_out, inst373_out, inst374_out, inst375_out,
       inst376_out, inst377_out, inst378_out, inst379_out, inst380_eq0, inst380_eq1, inst380_eq2,
       inst380_eq3, inst380_eq4, inst380_eq5, inst380_eq6, inst380_eq7, inst381_q, inst383_out, inst384_out,
       inst385_out, inst393_out, inst394_eq0, inst394_eq1, inst394_eq2, inst394_eq3, inst394_eq4,
       inst394_eq5, inst394_eq6, inst394_eq7, inst410_out, inst411_out, inst412_out, inst413_out,
       inst414_out, inst415_out, inst418_out, inst421_out, inst424_out, inst427_out, inst429_out,
       inst430_out, inst431_out, inst432_out, inst434_q, inst435_out, inst437_out, inst438_out, inst439_out,
       inst440_out, inst441_out, inst442_out, inst444_out, inst446_out, inst447_out, inst448_out,
       inst449_out, inst450_out, inst451_out, inst452_out, inst453_out, inst454_out, inst455_q, inst456_out,
       inst457_out, inst458_out, inst459_out, inst460_out, inst461_out, inst462_out, inst463_out,
       inst464_out, inst465_out, inst466_out, inst467_out, inst468_out, inst469_out, inst470_q, inst471_out,
       inst472_out, inst473_out, inst474_out, inst475_out, inst476_out, inst477_out, inst478_out,
       inst482_out, inst483_out, inst484_out, inst485_out, inst486_out, inst487_out, inst488_q, inst489_out,
       inst490_out, inst491_out, inst493_out, inst494_out, inst495_out, inst496_out, inst497_out,
       inst498_out, inst499_out, inst500_out, inst501_out, inst502_out, inst503_out, inst507_out,
       inst508_out, inst509_out, inst510_out, inst511_out, inst512_out, inst513_q, inst514_out, inst515_out,
       inst516_out, inst518_out, inst519_out, inst520_out, inst521_out, inst522_out, inst523_out,
       inst524_out, inst528_out, inst529_out, inst530_out, inst531_out, inst532_out, inst533_out, inst534_q,
       inst535_out, inst536_out, inst537_out, inst539_out, inst540_out, inst541_out, inst542_out,
       inst543_out, inst544_out, inst545_out, inst546_out, inst547_out, inst548_out, inst549_out,
       inst553_out, inst554_out, inst555_out, inst556_out, inst557_out, inst558_out, inst559_q, inst560_out,
       inst561_out, inst562_out, inst564_out, inst565_out, inst566_out, inst567_out, inst568_out,
       inst569_out, inst570_out, inst574_out, inst575_out, inst576_out, inst577_out, inst578_out,
       inst579_out, inst580_q, inst581_out, inst582_out, inst583_out, inst585_out, inst586_out, inst587_out,
       inst588_out, inst589_out, inst590_out, inst591_out, inst592_out, inst593_out, inst594_out,
       inst595_out, inst599_out, inst600_out, inst601_out, inst602_out, inst603_out, inst604_out, inst605_q,
       inst606_out, inst607_out, inst608_out, inst610_out, inst611_out, inst612_out, inst613_out,
       inst614_out, inst615_out, inst616_out, inst617_eq0, inst617_eq1, inst617_eq2, inst617_eq3,
       inst617_eq4, inst617_eq5, inst617_eq6, inst617_eq7, inst621_out, inst622_out, inst623_out,
       inst624_out, inst625_q, inst626_out, inst627_out, inst628_q, inst629_out, inst630_out, inst631_out,
       inst634_out, inst635_out, inst636_out, inst639_out, inst640_out, inst641_out, inst644_out,
       inst645_out, inst646_out, inst647_out, inst648_out, inst650_out, inst652_out, inst653_out,
       inst654_out, inst655_out, inst656_out, inst657_out, inst658_out, inst663_out, inst664_out,
       inst665_out, inst666_eq0, inst666_eq1, inst666_eq2, inst666_eq3, inst666_eq4, inst666_eq5,
       inst666_eq6, inst666_eq7, inst682_eq0, inst682_eq1, inst682_eq2, inst682_eq3, inst682_eq4,
       inst682_eq5, inst682_eq6, inst682_eq7, inst686_out, inst687_out, inst688_out, inst689_out, inst690_q,
       inst691_out, inst692_out, inst693_q, inst694_out, inst695_out, inst696_out, inst698_out, inst700_out,
       inst701_out, inst702_out, inst705_out, inst706_out, inst707_out, inst708_out, inst714_out,
       inst715_out, inst716_out, inst717_eq0, inst717_eq1, inst717_eq2, inst717_eq3, inst717_eq4,
       inst717_eq5, inst717_eq6, inst717_eq7, inst733_eq0, inst733_eq1, inst733_eq2, inst733_eq3,
       inst733_eq4, inst733_eq5, inst733_eq6, inst733_eq7, inst737_out, inst738_out, inst739_out,
       inst740_out, inst741_q, inst742_out, inst743_out, inst744_q, inst745_out, inst746_out, inst747_out,
       inst750_out, inst751_out, inst752_out, inst755_out, inst756_out, inst757_out, inst760_out,
       inst761_out, inst762_out, inst763_out, inst764_out, inst766_out, inst768_out, inst769_out,
       inst770_out, inst771_out, inst772_out, inst773_out, inst774_out, inst779_out, inst780_out,
       inst781_out, inst782_eq0, inst782_eq1, inst782_eq2, inst782_eq3, inst782_eq4, inst782_eq5,
       inst782_eq6, inst782_eq7, inst798_eq0, inst798_eq1, inst798_eq2, inst798_eq3, inst798_eq4,
       inst798_eq5, inst798_eq6, inst798_eq7, inst802_out, inst803_out, inst804_out, inst805_out, inst806_q,
       inst807_out, inst808_out, inst809_q, inst810_out, inst811_out, inst812_out, inst814_out, inst816_out,
       inst817_out, inst818_out, inst821_out, inst822_out, inst823_out, inst824_out, inst830_out,
       inst831_out, inst832_out, inst833_eq0, inst833_eq1, inst833_eq2, inst833_eq3, inst833_eq4,
       inst833_eq5, inst833_eq6, inst833_eq7, inst849_eq0, inst849_eq1, inst849_eq2, inst849_eq3,
       inst849_eq4, inst849_eq5, inst849_eq6, inst849_eq7, inst853_out, inst854_out, inst855_out,
       inst856_out, inst857_q, inst858_out, inst859_out, inst860_q, inst861_out, inst862_out, inst863_out,
       inst866_out, inst867_out, inst868_out, inst871_out, inst872_out, inst873_out, inst876_out,
       inst877_out, inst878_out, inst879_out, inst880_out, inst882_out, inst884_out, inst885_out,
       inst886_out, inst887_out, inst888_out, inst889_out, inst890_out, inst895_out, inst896_out,
       inst897_out, inst898_eq0, inst898_eq1, inst898_eq2, inst898_eq3, inst898_eq4, inst898_eq5,
       inst898_eq6, inst898_eq7, inst914_eq0, inst914_eq1, inst914_eq2, inst914_eq3, inst914_eq4,
       inst914_eq5, inst914_eq6, inst914_eq7, inst918_out, inst919_out, inst920_out, inst921_out, inst922_q,
       inst923_out, inst924_out, inst925_q, inst926_out, inst927_out, inst928_out, inst930_out, inst932_out,
       inst933_out, inst934_out, inst937_out, inst938_out, inst939_out, inst940_out, inst946_out,
       inst947_out, inst948_out, inst949_eq0, inst949_eq1, inst949_eq2, inst949_eq3, inst949_eq4,
       inst949_eq5, inst949_eq6, inst949_eq7, inst965_eq0, inst965_eq1, inst965_eq2, inst965_eq3,
       inst965_eq4, inst965_eq5, inst965_eq6, inst965_eq7, inst969_out, inst970_out, inst971_out,
       inst972_out, inst973_q, inst974_out, inst975_out, inst976_q, inst977_out, inst978_out, inst979_out,
       inst982_out, inst983_out, inst984_out, inst987_out, inst988_out, inst989_out, inst992_out,
       inst993_out, inst994_out, inst995_out, inst996_out, inst998_out, inst1000_out, inst1001_out,
       inst1002_out, inst1003_out, inst1004_out, inst1005_out, inst1006_out, inst1013_out, inst1014_out,
       inst1015_out, inst1016_out, inst1017_out, inst1018_out, inst1019_out, inst1020_out, inst1021_out,
       inst1022_out, inst1023_out, inst1024_out, inst1025_out, inst1026_out, inst1027_out, inst1028_out,
       inst1029_out, inst1030_out, k0, k1, k2, k3, k4, k5, k6, k7, t1, t2, t3, t4, t5, t6, t7, t11, t21, t31,
       t41, t51, t61, t71, w0, w01, w1, w2, w3, w4, w5, w6, w7, w11, w21, w31, w41, w51, w61, w71;
  wire [2:0] inst60_result, inst62_tridata, inst92_tridata, inst93_result, inst155_tridata, inst156_result,
       inst181_tridata, inst182_result, inst220_tridata, inst221_result, inst246_tridata, inst247_result,
       inst282_tridata, inst283_result, inst311_tridata, inst312_result, inst387_tridata, inst388_result,
       inst425_tridata, inst428_tridata, inst436_tridata, inst480_tridata, inst505_tridata, inst526_tridata,
       inst551_tridata, inst572_tridata, inst597_tridata, inst619_tridata, inst638_tridata, inst642_result,
       inst684_tridata, inst704_tridata, inst709_result, inst735_tridata, inst754_tridata, inst758_result,
       inst800_tridata, inst820_tridata, inst825_result, inst851_tridata, inst870_tridata, inst874_result,
       inst916_tridata, inst936_tridata, inst941_result, inst967_tridata, inst986_tridata, inst990_result,
       offset, set;
  wire [3:0] q;
  wire [4:0] inst1_tridata, inst14_q, inst38_q, inst63_q, inst64_tridata, inst88_tridata, inst158_q,
       inst159_tridata, inst197_q, inst198_tridata, inst223_q, inst224_tridata, inst259_q, inst260_tridata,
       inst285_q, inst286_tridata, inst332_q, inst333_tridata, inst390_q, inst391_tridata, inst660_q,
       inst661_tridata, inst711_q, inst712_tridata, inst776_q, inst777_tridata, inst827_q, inst828_tridata,
       inst892_q, inst893_tridata, inst943_q, inst944_tridata, tag0, tag1, ttt, zero;
  wire [4:1] tag;
  wire [7:0] inst37_q, inst137_q, inst138_q, inst139_q, inst140_q, inst141_q, inst142_q, inst143_q,
       inst157_q, inst163_q, inst164_q, inst165_q, inst166_q, inst167_q, inst168_q, inst169_q, inst196_q,
       inst202_q, inst203_q, inst204_q, inst205_q, inst206_q, inst207_q, inst208_q, inst222_q, inst228_q,
       inst229_q, inst230_q, inst231_q, inst232_q, inst233_q, inst234_q, inst258_q, inst264_q, inst265_q,
       inst266_q, inst267_q, inst268_q, inst269_q, inst270_q, inst284_q, inst290_q, inst291_q, inst292_q,
       inst293_q, inst294_q, inst295_q, inst298_q, inst331_q, inst337_q, inst338_q, inst339_q, inst340_q,
       inst341_q, inst342_q, inst343_q, inst389_q, inst395_q, inst396_q, inst397_q, inst398_q, inst399_q,
       inst400_q, inst401_q, inst659_q, inst667_q, inst668_q, inst669_q, inst670_q, inst671_q, inst672_q,
       inst673_q, inst710_q, inst718_q, inst719_q, inst720_q, inst721_q, inst722_q, inst723_q, inst724_q,
       inst775_q, inst783_q, inst784_q, inst785_q, inst786_q, inst787_q, inst788_q, inst789_q, inst826_q,
       inst834_q, inst835_q, inst836_q, inst837_q, inst838_q, inst839_q, inst840_q, inst891_q, inst899_q,
       inst900_q, inst901_q, inst902_q, inst903_q, inst904_q, inst905_q, inst942_q, inst950_q, inst951_q,
       inst952_q, inst953_q, inst954_q, inst955_q, inst956_q;
  wire [9:0] tagad;

  not inst135 (inst135_out, clk);
  not inst113 (inst113_out, hit);
  and inst114 (inst114_out, inst135_out, inst113_out);
  lpm_counter0 inst39 (.clock(inst114_out), .q(q), .cout(cout));
  lpm_bustri4 inst132 (.enabledt(eq0), .data(k0), .tridata(inst132_tridata));
  lpm_bustri4 inst193 (.enabledt(eq1), .data(k1), .tridata(inst132_tridata));
  lpm_bustri4 inst1007 (.enabledt(eq2), .data(k2), .tridata(inst132_tridata));
  lpm_bustri4 inst1008 (.enabledt(eq3), .data(k3), .tridata(inst132_tridata));
  lpm_bustri4 inst1009 (.enabledt(eq4), .data(k4), .tridata(inst132_tridata));
  lpm_bustri4 inst1010 (.enabledt(eq5), .data(k5), .tridata(inst132_tridata));
  lpm_bustri4 inst1011 (.enabledt(eq6), .data(k6), .tridata(inst132_tridata));
  lpm_bustri4 inst1012 (.enabledt(eq7), .data(k7), .tridata(inst132_tridata));
  lpm_bustri1 inst96 (.enabledt(inst133_out), .data(tag0), .tridata(ttt));
  not inst133 (inst133_out, inst132_tridata);
  lpm_bustri1 inst97 (.enabledt(inst132_tridata), .data(tag1), .tridata(ttt));
  assign ad[9] = address[9];  // WIRE inst115
  assign ad[8] = address[8];  // WIRE inst112
  assign ad[7] = address[7];  // WIRE inst104
  assign ad[6] = address[6];  // WIRE inst105
  assign ad[5] = address[5];  // WIRE inst106
  assign ad[4] = address[4];  // WIRE inst107
  assign ad[3] = address[3];  // WIRE inst108
  assign ad[2] = q[2];  // WIRE inst109
  assign ad[1] = q[1];  // WIRE inst110
  assign ad[0] = q[0];  // WIRE inst111
  assign tagad[0] = ad[0];  // WIRE inst98
  assign tagad[1] = ad[1];  // WIRE inst99
  assign tagad[2] = ad[2];  // WIRE inst100
  assign tagad[3] = ad[3];  // WIRE inst101
  assign tagad[4] = ad[4];  // WIRE inst117
  assign tagad[5] = ad[5];  // WIRE inst118
  assign tagad[6] = ttt[1];  // WIRE inst119
  assign tagad[7] = ttt[2];  // WIRE inst120
  assign tagad[8] = ttt[3];  // WIRE inst121
  assign tagad[9] = ttt[4];  // WIRE inst122
  and inst68 (inst68_out, c00, t0);
  and inst1013 (inst1013_out, c01, t1);
  and inst1014 (inst1014_out, c02, t2);
  and inst1015 (inst1015_out, c03, t3);
  and inst1016 (inst1016_out, c04, t4);
  and inst1017 (inst1017_out, c05, t5);
  and inst1018 (inst1018_out, c06, t6);
  and inst1019 (inst1019_out, c07, t7);
  and inst1021 (inst1021_out, c10, t01);
  and inst1022 (inst1022_out, c11, t11);
  and inst1023 (inst1023_out, c12, t21);
  and inst1024 (inst1024_out, c13, t31);
  and inst1025 (inst1025_out, c14, t41);
  and inst1026 (inst1026_out, c15, t51);
  and inst1027 (inst1027_out, c16, t61);
  and inst1028 (inst1028_out, c17, t71);
  lpm_compare0 inst19 (.dataa({tag, 1'b1}), .datab(tag0), .aeb(com0));
  or inst1020 (inst1020_out, inst68_out, inst1013_out, inst1014_out, inst1015_out, inst1016_out, inst1017_out, inst1018_out, inst1019_out);
  or inst1029 (inst1029_out, inst1021_out, inst1022_out, inst1023_out, inst1024_out, inst1025_out, inst1026_out, inst1027_out, inst1028_out);
  and inst42 (c00, com0, eq0);
  and inst43 (c01, com0, eq1);
  and inst44 (c02, com0, eq2);
  and inst45 (c03, com0, eq3);
  and inst46 (c04, com0, eq4);
  and inst47 (c05, com0, eq5);
  and inst48 (c06, com0, eq6);
  and inst49 (c07, com0, eq7);
  or inst1030 (inst1030_out, inst1020_out, inst1029_out);
  lpm_constant0 inst16 (.result(zero));
  lpm_decode0 inst12 (
    .data(set), .enable(1'b1), .eq0(eq0), .eq1(eq1), .eq2(eq2), .eq3(eq3), .eq4(eq4), .eq5(eq5), .eq6(eq6),
    .eq7(eq7));
  and inst1033 (clk, ask_data, clk_);
  and inst1031 (strobe, inst1030_out, hit);
  assign offset[0] = address[0];  // WIRE inst
  assign offset[1] = address[1];  // WIRE inst2
  assign offset[2] = address[2];  // WIRE inst3
  assign set[0] = address[3];  // WIRE inst4
  assign set[1] = address[4];  // WIRE inst5
  assign set[2] = address[5];  // WIRE inst6
  assign tag[1] = address[6];  // WIRE inst7
  assign tag[2] = address[7];  // WIRE inst8
  assign tag[3] = address[8];  // WIRE inst9
  assign tag[4] = address[9];  // WIRE inst10
  lpm_compare0 inst36 (.dataa({tag, 1'b1}), .datab(tag1), .aeb(com1));
  and inst52 (c10, com1, eq0);
  and inst53 (c11, com1, eq1);
  and inst54 (c12, com1, eq2);
  and inst55 (c13, com1, eq3);
  and inst56 (c14, com1, eq4);
  and inst57 (c15, com1, eq5);
  and inst58 (c16, com1, eq6);
  and inst59 (c17, com1, eq7);
  or inst66 (inst66_out, w0, w01, w1, w11, w2, w21, w3, w31);
  or inst51 (hit, com0, com1);
  or inst195 (i_write_read, inst194_out, inst66_out);
  or inst194 (inst194_out, w4, w41, w5, w51, w6, w61, w7, w71);
  DFF inst318 (.CLK(clk), .D(cout), .Q(inst318_q));  // open: CLRN, PRN
  and inst94 (inst94_out, hit, eq0);
  not inst432 (inst432_out, inst318_q);
  and inst433 (cout0, cout, inst432_out);
  TFF inst50 (.T(inst94_out), .CLK(inst94_out), .Q(k0));  // open: PRN, CLRN
  DFF inst434 (.CLK(clk), .D(cout0), .Q(inst434_q));  // open: CLRN, PRN
  not inst446 (inst446_out, k0);
  not inst410 (inst410_out, hit);
  not inst447 (inst447_out, t0);
  and inst441 (inst441_out, inst434_q, eq0);
  and inst65 (inst65_out, inst446_out, eq0, inst410_out, cout, inst447_out);
  DFF inst320 (.CLK(clk), .D(cout), .Q(inst320_q));  // open: CLRN, PRN
  not inst429 (inst429_out, inst434_q);
  lpm_bustri1 inst1 (.enabledt(inst18_out), .data(zero), .tridata(inst1_tridata));
  lpm_bustri1 inst17 (.enabledt(inst65_out), .data({tag, 1'b1}), .tridata(inst1_tridata));
  not inst468 (inst468_out, inst320_q);
  and inst184 (inst184_out, hit, eq1);
  and inst430 (inst430_out, inst429_out, c00);
  or inst440 (inst440_out, c00, inst441_out);
  and inst431 (inst431_out, inst440_out, clk);
  not inst18 (inst18_out, inst65_out);
  and inst469 (inst469_out, cout, inst468_out);
  TFF inst183 (.T(inst184_out), .CLK(inst184_out), .Q(k1));  // open: PRN, CLRN
  DFF inst416 (.CLK(inst431_out), .D(inst430_out), .Q(t0));  // open: CLRN, PRN
  not inst496 (inst496_out, k1);
  not inst412 (inst412_out, hit);
  not inst463 (inst463_out, t1);
  lpm_bustri2 inst425 (.enabledt(inst128_out), .data(ad[2:0]), .tridata(inst425_tridata));
  lpm_bustri2 inst426 (.enabledt(inst427_out), .data(offset), .tridata(inst425_tridata));
  lpm_dff1 inst14 (.data(inst1_tridata), .clock(clk), .enable(inst65_out), .q(inst14_q));
  lpm_add_sub1 inst60 (.dataa(ad[2:0]), .result(inst60_result));
  DFF inst470 (.CLK(clk), .D(inst469_out), .Q(inst470_q));  // open: CLRN, PRN
  and inst185 (inst185_out, inst496_out, eq1, inst412_out, cout, inst463_out);
  DFF inst322 (.CLK(clk), .D(cout), .Q(inst322_q));  // open: CLRN, PRN
  and inst128 (inst128_out, i_write_read, eq0, t0);
  not inst427 (inst427_out, inst128_out);
  and inst352 (inst352_out, c00, \read-write );
  not inst414 (inst414_out, hit);
  not inst442 (inst442_out, k0);
  not inst439 (inst439_out, t0);
  not inst465 (inst465_out, inst470_q);
  and inst472 (inst472_out, inst470_q, eq1);
  not inst511 (inst511_out, inst322_q);
  and inst249 (inst249_out, hit, eq2);
  and inst466 (inst466_out, inst465_out, c01);
  or inst471 (inst471_out, c01, inst472_out);
  and inst467 (inst467_out, inst471_out, clk);
  lpm_bustri1 inst88 (.enabledt(inst134_out), .data(zero), .tridata(inst88_tridata));
  not inst134 (inst134_out, inst185_out);
  lpm_bustri1 inst89 (.enabledt(inst185_out), .data({tag, 1'b1}), .tridata(inst88_tridata));
  and inst512 (inst512_out, cout, inst511_out);
  not inst435 (inst435_out, k0);
  not inst462 (inst462_out, hit);
  lpm_bustri1 inst41 (.enabledt(eq0), .data(inst14_q), .tridata(tag0));
  lpm_bustri2 inst62 (.enabledt(inst352_out), .data(offset), .tridata(inst62_tridata));
  not inst355 (inst355_out, inst352_out);
  lpm_bustri2 inst61 (.enabledt(inst355_out), .data(inst60_result), .tridata(inst62_tridata));
  and inst438 (inst438_out, eq0, inst414_out, inst442_out, inst439_out);
  TFF inst248 (.T(inst249_out), .CLK(inst249_out), .Q(k2));  // open: PRN, CLRN
  not inst502 (inst502_out, hit);
  not inst503 (inst503_out, t2);
  and inst131 (inst131_out, inst435_out, eq0, inst462_out, t0);
  or inst356 (inst356_out, inst352_out, inst438_out);
  DFF inst422 (.CLK(inst467_out), .D(inst466_out), .Q(t1));  // open: CLRN, PRN
  lpm_dff1 inst38 (.data(inst88_tridata), .clock(clk), .enable(inst185_out), .q(inst38_q));
  lpm_add_sub1 inst156 (.dataa(ad[2:0]), .result(inst156_result));
  DFF inst513 (.CLK(clk), .D(inst512_out), .Q(inst513_q));  // open: CLRN, PRN
  not inst542 (inst542_out, k2);
  DFF inst324 (.CLK(clk), .D(cout), .Q(inst324_q));  // open: CLRN, PRN
  and inst314 (inst314_out, hit, eq3);
  and inst189 (inst189_out, i_write_read, eq1, t1);
  lpm_bustri2 inst428 (.enabledt(inst189_out), .data(ad[2:0]), .tridata(inst428_tridata));
  not inst464 (inst464_out, inst189_out);
  lpm_bustri2 inst445 (.enabledt(inst464_out), .data(offset), .tridata(inst428_tridata));
  and inst354 (inst354_out, c01, \read-write );
  and inst515 (inst515_out, inst513_q, eq2);
  and inst250 (inst250_out, inst542_out, eq2, inst502_out, cout, inst503_out);
  not inst557 (inst557_out, inst324_q);
  or inst437 (inst437_out, inst131_out, c00);
  not inst474 (inst474_out, hit);
  not inst477 (inst477_out, k1);
  not inst476 (inst476_out, t1);
  not inst508 (inst508_out, inst513_q);
  or inst514 (inst514_out, c02, inst515_out);
  lpm_bustri1 inst198 (.enabledt(inst200_out), .data(zero), .tridata(inst198_tridata));
  lpm_bustri1 inst199 (.enabledt(inst250_out), .data({tag, 1'b1}), .tridata(inst198_tridata));
  and inst558 (inst558_out, cout, inst557_out);
  TFF inst313 (.T(inst314_out), .CLK(inst314_out), .Q(k3));  // open: PRN, CLRN
  lpm_decode0 inst13 (
    .data(inst62_tridata), .enable(inst356_out), .eq0(inst13_eq0), .eq1(inst13_eq1), .eq2(inst13_eq2),
    .eq3(inst13_eq3), .eq4(inst13_eq4), .eq5(inst13_eq5), .eq6(inst13_eq6), .eq7(inst13_eq7));
  lpm_bustri1 inst153 (.enabledt(eq1), .data(inst38_q), .tridata(tag0));
  lpm_bustri2 inst155 (.enabledt(inst354_out), .data(offset), .tridata(inst155_tridata));
  not inst359 (inst359_out, inst354_out);
  lpm_bustri2 inst154 (.enabledt(inst359_out), .data(inst156_result), .tridata(inst155_tridata));
  and inst475 (inst475_out, eq1, inst474_out, inst477_out, inst476_out);
  and inst509 (inst509_out, inst508_out, c02);
  and inst510 (inst510_out, inst514_out, clk);
  not inst200 (inst200_out, inst250_out);
  DFF inst559 (.CLK(clk), .D(inst558_out), .Q(inst559_q));  // open: CLRN, PRN
  not inst588 (inst588_out, k3);
  not inst548 (inst548_out, hit);
  not inst549 (inst549_out, t3);
  lpm_decode0 inst35 (
    .data(inst425_tridata), .enable(inst437_out), .eq0(inst35_eq0), .eq1(inst35_eq1), .eq2(inst35_eq2),
    .eq3(inst35_eq3), .eq4(inst35_eq4), .eq5(inst35_eq5), .eq6(inst35_eq6), .eq7(inst35_eq7));
  not inst501 (inst501_out, k1);
  not inst500 (inst500_out, hit);
  or inst360 (inst360_out, inst354_out, inst475_out);
  DFF inst504 (.CLK(inst510_out), .D(inst509_out), .Q(t2));  // open: CLRN, PRN
  and inst315 (inst315_out, inst588_out, eq3, inst548_out, cout, inst549_out);
  DFF inst381 (.CLK(clk), .D(cout), .Q(inst381_q));  // open: CLRN, PRN
  and inst192 (inst192_out, inst501_out, eq1, inst500_out, t1);
  and inst254 (inst254_out, i_write_read, eq2, t2);
  lpm_bustri2 inst505 (.enabledt(inst254_out), .data(ad[2:0]), .tridata(inst505_tridata));
  not inst507 (inst507_out, inst254_out);
  lpm_bustri2 inst506 (.enabledt(inst507_out), .data(offset), .tridata(inst505_tridata));
  lpm_dff1 inst197 (.data(inst198_tridata), .clock(clk), .enable(inst250_out), .q(inst197_q));
  lpm_add_sub1 inst221 (.dataa(ad[2:0]), .result(inst221_result));
  not inst554 (inst554_out, inst559_q);
  and inst561 (inst561_out, inst559_q, eq3);
  and inst644 (inst644_out, hit, eq4);
  or inst473 (inst473_out, inst192_out, c01);
  and inst364 (inst364_out, c02, \read-write );
  not inst519 (inst519_out, hit);
  not inst522 (inst522_out, k2);
  not inst521 (inst521_out, t2);
  and inst555 (inst555_out, inst554_out, c03);
  or inst560 (inst560_out, c03, inst561_out);
  and inst556 (inst556_out, inst560_out, clk);
  lpm_bustri1 inst260 (.enabledt(inst262_out), .data(zero), .tridata(inst260_tridata));
  not inst262 (inst262_out, inst315_out);
  lpm_bustri1 inst261 (.enabledt(inst315_out), .data({tag, 1'b1}), .tridata(inst260_tridata));
  and inst604 (inst604_out, cout, inst603_out);
  not inst603 (inst603_out, inst381_q);
  lpm_bustri1 inst218 (.enabledt(eq2), .data(inst197_q), .tridata(tag0));
  lpm_bustri2 inst220 (.enabledt(inst364_out), .data(offset), .tridata(inst220_tridata));
  lpm_bustri2 inst219 (.enabledt(inst365_out), .data(inst221_result), .tridata(inst220_tridata));
  and inst520 (inst520_out, eq2, inst519_out, inst522_out, inst521_out);
  DFF inst550 (.CLK(inst556_out), .D(inst555_out), .Q(t3));  // open: CLRN, PRN
  TFF inst643 (.T(inst644_out), .CLK(inst644_out), .Q(k4));  // open: PRN, CLRN
  lpm_dff0 inst11 (.data(data), .clock(clk), .enable(inst13_eq0), .q(dff0));
  lpm_decode0 inst152 (
    .data(inst428_tridata), .enable(inst473_out), .eq0(inst152_eq0), .eq1(inst152_eq1), .eq2(inst152_eq2),
    .eq3(inst152_eq3), .eq4(inst152_eq4), .eq5(inst152_eq5), .eq6(inst152_eq6), .eq7(inst152_eq7));
  lpm_decode0 inst136 (
    .data(inst155_tridata), .enable(inst360_out), .eq0(inst136_eq0), .eq1(inst136_eq1), .eq2(inst136_eq2),
    .eq3(inst136_eq3), .eq4(inst136_eq4), .eq5(inst136_eq5), .eq6(inst136_eq6), .eq7(inst136_eq7));
  not inst547 (inst547_out, k2);
  not inst546 (inst546_out, hit);
  not inst365 (inst365_out, inst364_out);
  lpm_bustri2 inst551 (.enabledt(inst327_out), .data(ad[2:0]), .tridata(inst551_tridata));
  lpm_bustri2 inst552 (.enabledt(inst553_out), .data(offset), .tridata(inst551_tridata));
  lpm_dff1 inst259 (.data(inst260_tridata), .clock(clk), .enable(inst315_out), .q(inst259_q));
  lpm_add_sub1 inst283 (.dataa(ad[2:0]), .result(inst283_result));
  DFF inst605 (.CLK(clk), .D(inst604_out), .Q(inst605_q));  // open: CLRN, PRN
  not inst646 (inst646_out, k4);
  not inst594 (inst594_out, hit);
  not inst595 (inst595_out, t4);
  DFF inst690 (.CLK(clk), .D(cout), .Q(inst690_q));  // open: CLRN, PRN
  and inst760 (inst760_out, hit, eq5);
  and inst257 (inst257_out, inst547_out, eq2, inst546_out, t2);
  or inst366 (inst366_out, inst364_out, inst520_out);
  and inst327 (inst327_out, i_write_read, eq3, t3);
  not inst553 (inst553_out, inst327_out);
  and inst374 (inst374_out, c03, \read-write );
  and inst607 (inst607_out, inst605_q, eq4);
  and inst645 (inst645_out, inst646_out, eq4, inst594_out, cout, inst595_out);
  not inst691 (inst691_out, inst690_q);
  lpm_bustri0 inst27 (.enabledt(inst35_eq0), .data(dff0), .tridata(data_o));
  or inst516 (inst516_out, inst257_out, c02);
  not inst565 (inst565_out, hit);
  not inst568 (inst568_out, k3);
  not inst567 (inst567_out, t3);
  not inst600 (inst600_out, inst605_q);
  lpm_bustri1 inst333 (.enabledt(inst335_out), .data(zero), .tridata(inst333_tridata));
  lpm_bustri1 inst334 (.enabledt(inst645_out), .data({tag, 1'b1}), .tridata(inst333_tridata));
  and inst692 (inst692_out, cout, inst691_out);
  TFF inst759 (.T(inst760_out), .CLK(inst760_out), .Q(k5));  // open: PRN, CLRN
  lpm_dff0 inst20 (.data(data), .clock(clk), .enable(inst13_eq1), .q(dff1));
  not inst593 (inst593_out, k3);
  not inst592 (inst592_out, hit);
  lpm_bustri1 inst280 (.enabledt(eq3), .data(inst259_q), .tridata(tag0));
  lpm_bustri2 inst282 (.enabledt(inst374_out), .data(offset), .tridata(inst282_tridata));
  not inst375 (inst375_out, inst374_out);
  lpm_bustri2 inst281 (.enabledt(inst375_out), .data(inst283_result), .tridata(inst282_tridata));
  and inst566 (inst566_out, eq3, inst565_out, inst568_out, inst567_out);
  and inst601 (inst601_out, inst600_out, c04);
  or inst606 (inst606_out, c04, inst607_out);
  and inst602 (inst602_out, inst606_out, clk);
  not inst335 (inst335_out, inst645_out);
  DFF inst693 (.CLK(clk), .D(inst692_out), .Q(inst693_q));  // open: CLRN, PRN
  not inst762 (inst762_out, k5);
  not inst664 (inst664_out, hit);
  not inst665 (inst665_out, t5);
  lpm_dff0 inst37 (.data(data), .clock(clk), .enable(inst136_eq0), .q(inst37_q));
  lpm_decode0 inst201 (
    .data(inst220_tridata), .enable(inst366_out), .eq0(inst201_eq0), .eq1(inst201_eq1), .eq2(inst201_eq2),
    .eq3(inst201_eq3), .eq4(inst201_eq4), .eq5(inst201_eq5), .eq6(inst201_eq6), .eq7(inst201_eq7));
  or inst376 (inst376_out, inst374_out, inst566_out);
  DFF inst596 (.CLK(inst602_out), .D(inst601_out), .Q(t4));  // open: CLRN, PRN
  and inst695 (inst695_out, inst693_q, eq5);
  and inst761 (inst761_out, inst762_out, eq5, inst664_out, cout, inst665_out);
  DFF inst806 (.CLK(clk), .D(cout), .Q(inst806_q));  // open: CLRN, PRN
  and inst876 (inst876_out, hit, eq6);
  lpm_decode0 inst217 (
    .data(inst505_tridata), .enable(inst516_out), .eq0(inst217_eq0), .eq1(inst217_eq1), .eq2(inst217_eq2),
    .eq3(inst217_eq3), .eq4(inst217_eq4), .eq5(inst217_eq5), .eq6(inst217_eq6), .eq7(inst217_eq7));
  and inst330 (inst330_out, inst593_out, eq3, inst592_out, t3);
  and inst652 (inst652_out, i_write_read, eq4, t4);
  lpm_bustri2 inst597 (.enabledt(inst652_out), .data(ad[2:0]), .tridata(inst597_tridata));
  lpm_bustri2 inst598 (.enabledt(inst599_out), .data(offset), .tridata(inst597_tridata));
  lpm_dff1 inst332 (.data(inst333_tridata), .clock(clk), .enable(inst645_out), .q(inst332_q));
  lpm_add_sub1 inst388 (.dataa(ad[2:0]), .result(inst388_result));
  not inst687 (inst687_out, inst693_q);
  lpm_bustri1 inst661 (.enabledt(inst663_out), .data(zero), .tridata(inst661_tridata));
  lpm_bustri1 inst662 (.enabledt(inst761_out), .data({tag, 1'b1}), .tridata(inst661_tridata));
  not inst807 (inst807_out, inst806_q);
  lpm_bustri3 inst123 (.enabledt(inst125_out), .data(ad), .tridata(address_o));
  not inst125 (inst125_out, i_write_read);
  lpm_bustri3 inst124 (.enabledt(i_write_read), .data(tagad), .tridata(address_o));
  lpm_bustri0 inst28 (.enabledt(inst35_eq1), .data(dff1), .tridata(data_o));
  lpm_bustri0 inst144 (.enabledt(inst152_eq0), .data(inst37_q), .tridata(data_o));
  or inst562 (inst562_out, inst330_out, c03);
  not inst599 (inst599_out, inst652_out);
  and inst383 (inst383_out, c04, \read-write );
  not inst611 (inst611_out, hit);
  not inst614 (inst614_out, k4);
  not inst613 (inst613_out, t4);
  and inst688 (inst688_out, inst687_out, c05);
  or inst694 (inst694_out, c05, inst695_out);
  and inst689 (inst689_out, inst694_out, clk);
  not inst663 (inst663_out, inst761_out);
  and inst808 (inst808_out, cout, inst807_out);
  TFF inst875 (.T(inst876_out), .CLK(inst876_out), .Q(k6));  // open: PRN, CLRN
  DFF inst922 (.CLK(clk), .D(cout), .Q(inst922_q));  // open: CLRN, PRN
  and inst992 (inst992_out, hit, eq7);
  not inst102 (inst102_out, hit);
  lpm_dff0 inst21 (.data(data), .clock(clk), .enable(inst13_eq2), .q(dff2));
  lpm_decode0 inst263 (
    .data(inst282_tridata), .enable(inst376_out), .eq0(inst263_eq0), .eq1(inst263_eq1), .eq2(inst263_eq2),
    .eq3(inst263_eq3), .eq4(inst263_eq4), .eq5(inst263_eq5), .eq6(inst263_eq6), .eq7(inst263_eq7));
  lpm_bustri1 inst382 (.enabledt(eq4), .data(inst332_q), .tridata(tag0));
  lpm_bustri2 inst387 (.enabledt(inst383_out), .data(offset), .tridata(inst387_tridata));
  lpm_bustri2 inst386 (.enabledt(inst384_out), .data(inst388_result), .tridata(inst387_tridata));
  DFF inst683 (.CLK(inst689_out), .D(inst688_out), .Q(t5));  // open: CLRN, PRN
  DFF inst809 (.CLK(clk), .D(inst808_out), .Q(inst809_q));  // open: CLRN, PRN
  not inst878 (inst878_out, k6);
  not inst780 (inst780_out, hit);
  not inst781 (inst781_out, t6);
  not inst923 (inst923_out, inst922_q);
  and inst116 (inlock, clk, inst102_out);
  lpm_dff0 inst137 (.data(data), .clock(clk), .enable(inst136_eq1), .q(inst137_q));
  lpm_dff0 inst196 (.data(data), .clock(clk), .enable(inst201_eq0), .q(inst196_q));
  lpm_decode0 inst279 (
    .data(inst551_tridata), .enable(inst562_out), .eq0(inst279_eq0), .eq1(inst279_eq1), .eq2(inst279_eq2),
    .eq3(inst279_eq3), .eq4(inst279_eq4), .eq5(inst279_eq5), .eq6(inst279_eq6), .eq7(inst279_eq7));
  not inst658 (inst658_out, k4);
  not inst657 (inst657_out, hit);
  not inst384 (inst384_out, inst383_out);
  and inst612 (inst612_out, eq4, inst611_out, inst614_out, inst613_out);
  lpm_bustri2 inst684 (.enabledt(inst768_out), .data(ad[2:0]), .tridata(inst684_tridata));
  lpm_bustri2 inst685 (.enabledt(inst686_out), .data(offset), .tridata(inst684_tridata));
  lpm_dff1 inst660 (.data(inst661_tridata), .clock(clk), .enable(inst761_out), .q(inst660_q));
  lpm_add_sub1 inst709 (.dataa(ad[2:0]), .result(inst709_result));
  and inst877 (inst877_out, inst878_out, eq6, inst780_out, cout, inst781_out);
  and inst924 (inst924_out, cout, inst923_out);
  TFF inst991 (.T(inst992_out), .CLK(inst992_out), .Q(k7));  // open: PRN, CLRN
  lpm_bustri0 inst29 (.enabledt(inst35_eq2), .data(dff2), .tridata(data_o));
  and inst656 (inst656_out, inst658_out, eq4, inst657_out, t4);
  or inst385 (inst385_out, inst383_out, inst612_out);
  and inst768 (inst768_out, i_write_read, eq5, t5);
  not inst686 (inst686_out, inst768_out);
  and inst700 (inst700_out, c05, \read-write );
  not inst705 (inst705_out, hit);
  not inst708 (inst708_out, k5);
  not inst707 (inst707_out, t5);
  not inst803 (inst803_out, inst809_q);
  and inst811 (inst811_out, inst809_q, eq6);
  DFF inst925 (.CLK(clk), .D(inst924_out), .Q(inst925_q));  // open: CLRN, PRN
  not inst994 (inst994_out, k7);
  not inst896 (inst896_out, hit);
  not inst897 (inst897_out, t7);
  not inst103 (ask, hit);
  lpm_bustri0 inst145 (.enabledt(inst152_eq1), .data(inst137_q), .tridata(data_o));
  or inst608 (inst608_out, inst656_out, c04);
  and inst804 (inst804_out, inst803_out, c06);
  or inst810 (inst810_out, c06, inst811_out);
  and inst805 (inst805_out, inst810_out, clk);
  lpm_bustri1 inst777 (.enabledt(inst779_out), .data(zero), .tridata(inst777_tridata));
  not inst779 (inst779_out, inst877_out);
  lpm_bustri1 inst778 (.enabledt(inst877_out), .data({tag, 1'b1}), .tridata(inst777_tridata));
  and inst927 (inst927_out, inst925_q, eq7);
  and inst993 (inst993_out, inst994_out, eq7, inst896_out, cout, inst897_out);
  lpm_dff0 inst22 (.data(data), .clock(clk), .enable(inst13_eq3), .q(dff3));
  lpm_dff0 inst138 (.data(data), .clock(clk), .enable(inst136_eq2), .q(inst138_q));
  lpm_bustri0 inst209 (.enabledt(inst217_eq0), .data(inst196_q), .tridata(data_o));
  not inst774 (inst774_out, k5);
  not inst773 (inst773_out, hit);
  lpm_bustri1 inst699 (.enabledt(eq5), .data(inst660_q), .tridata(tag0));
  lpm_bustri2 inst704 (.enabledt(inst700_out), .data(offset), .tridata(inst704_tridata));
  not inst701 (inst701_out, inst700_out);
  lpm_bustri2 inst703 (.enabledt(inst701_out), .data(inst709_result), .tridata(inst704_tridata));
  and inst706 (inst706_out, eq5, inst705_out, inst708_out, inst707_out);
  DFF inst799 (.CLK(inst805_out), .D(inst804_out), .Q(t6));  // open: CLRN, PRN
  not inst919 (inst919_out, inst925_q);
  lpm_bustri1 inst893 (.enabledt(inst895_out), .data(zero), .tridata(inst893_tridata));
  lpm_bustri1 inst894 (.enabledt(inst993_out), .data({tag, 1'b1}), .tridata(inst893_tridata));
  lpm_dff0 inst202 (.data(data), .clock(clk), .enable(inst201_eq1), .q(inst202_q));
  lpm_dff0 inst258 (.data(data), .clock(clk), .enable(inst263_eq0), .q(inst258_q));
  lpm_decode0 inst336 (
    .data(inst387_tridata), .enable(inst385_out), .eq0(inst336_eq0), .eq1(inst336_eq1), .eq2(inst336_eq2),
    .eq3(inst336_eq3), .eq4(inst336_eq4), .eq5(inst336_eq5), .eq6(inst336_eq6), .eq7(inst336_eq7));
  and inst772 (inst772_out, inst774_out, eq5, inst773_out, t5);
  or inst702 (inst702_out, inst700_out, inst706_out);
  lpm_bustri2 inst800 (.enabledt(inst884_out), .data(ad[2:0]), .tridata(inst800_tridata));
  lpm_bustri2 inst801 (.enabledt(inst802_out), .data(offset), .tridata(inst800_tridata));
  lpm_dff1 inst776 (.data(inst777_tridata), .clock(clk), .enable(inst877_out), .q(inst776_q));
  lpm_add_sub1 inst825 (.dataa(ad[2:0]), .result(inst825_result));
  and inst920 (inst920_out, inst919_out, c07);
  or inst926 (inst926_out, c07, inst927_out);
  and inst921 (inst921_out, inst926_out, clk);
  not inst895 (inst895_out, inst993_out);
  lpm_decode0 inst380 (
    .data(inst597_tridata), .enable(inst608_out), .eq0(inst380_eq0), .eq1(inst380_eq1), .eq2(inst380_eq2),
    .eq3(inst380_eq3), .eq4(inst380_eq4), .eq5(inst380_eq5), .eq6(inst380_eq6), .eq7(inst380_eq7));
  and inst884 (inst884_out, i_write_read, eq6, t6);
  not inst802 (inst802_out, inst884_out);
  and inst816 (inst816_out, c06, \read-write );
  DFF inst915 (.CLK(inst921_out), .D(inst920_out), .Q(t7));  // open: CLRN, PRN
  lpm_bustri0 inst296 (.enabledt(inst368_out), .data(data_i), .tridata(data));
  not inst369 (inst369_out, i_write_read);
  and inst370 (inst370_out, hit, inst369_out);
  lpm_bustri0 inst302 (.enabledt(inst370_out), .data(wtite), .tridata(data));
  lpm_bustri0 inst30 (.enabledt(inst35_eq3), .data(dff3), .tridata(data_o));
  lpm_bustri0 inst146 (.enabledt(inst152_eq2), .data(inst138_q), .tridata(data_o));
  lpm_bustri0 inst210 (.enabledt(inst217_eq1), .data(inst202_q), .tridata(data_o));
  lpm_bustri0 inst271 (.enabledt(inst279_eq0), .data(inst258_q), .tridata(data_o));
  or inst696 (inst696_out, inst772_out, c05);
  not inst821 (inst821_out, hit);
  not inst824 (inst824_out, k6);
  not inst823 (inst823_out, t6);
  lpm_bustri2 inst916 (.enabledt(inst1000_out), .data(ad[2:0]), .tridata(inst916_tridata));
  lpm_bustri2 inst917 (.enabledt(inst918_out), .data(offset), .tridata(inst916_tridata));
  lpm_dff1 inst892 (.data(inst893_tridata), .clock(clk), .enable(inst993_out), .q(inst892_q));
  lpm_add_sub1 inst941 (.dataa(ad[2:0]), .result(inst941_result));
  not inst297 (inst297_out, hit);
  lpm_dff0 inst23 (.data(data), .clock(clk), .enable(inst13_eq4), .q(dff4));
  lpm_decode0 inst666 (
    .data(inst704_tridata), .enable(inst702_out), .eq0(inst666_eq0), .eq1(inst666_eq1), .eq2(inst666_eq2),
    .eq3(inst666_eq3), .eq4(inst666_eq4), .eq5(inst666_eq5), .eq6(inst666_eq6), .eq7(inst666_eq7));
  not inst890 (inst890_out, k6);
  not inst889 (inst889_out, hit);
  lpm_bustri1 inst815 (.enabledt(eq6), .data(inst776_q), .tridata(tag0));
  lpm_bustri2 inst820 (.enabledt(inst816_out), .data(offset), .tridata(inst820_tridata));
  not inst817 (inst817_out, inst816_out);
  lpm_bustri2 inst819 (.enabledt(inst817_out), .data(inst825_result), .tridata(inst820_tridata));
  and inst822 (inst822_out, eq6, inst821_out, inst824_out, inst823_out);
  and inst1000 (inst1000_out, i_write_read, eq7, t7);
  not inst918 (inst918_out, inst1000_out);
  and inst932 (inst932_out, c07, \read-write );
  not inst937 (inst937_out, hit);
  not inst940 (inst940_out, k7);
  not inst939 (inst939_out, t7);
  and inst368 (inst368_out, inst297_out, inst367_out);
  not inst367 (inst367_out, i_write_read);
  lpm_dff0 inst139 (.data(data), .clock(clk), .enable(inst136_eq3), .q(inst139_q));
  lpm_dff0 inst203 (.data(data), .clock(clk), .enable(inst201_eq2), .q(inst203_q));
  lpm_dff0 inst264 (.data(data), .clock(clk), .enable(inst263_eq1), .q(inst264_q));
  lpm_decode0 inst682 (
    .data(inst684_tridata), .enable(inst696_out), .eq0(inst682_eq0), .eq1(inst682_eq1), .eq2(inst682_eq2),
    .eq3(inst682_eq3), .eq4(inst682_eq4), .eq5(inst682_eq5), .eq6(inst682_eq6), .eq7(inst682_eq7));
  or inst818 (inst818_out, inst816_out, inst822_out);
  lpm_bustri0 inst31 (.enabledt(inst35_eq4), .data(dff4), .tridata(data_o));
  lpm_dff0 inst331 (.data(data), .clock(clk), .enable(inst336_eq0), .q(inst331_q));
  and inst888 (inst888_out, inst890_out, eq6, inst889_out, t6);
  not inst1006 (inst1006_out, k7);
  not inst1005 (inst1005_out, hit);
  lpm_bustri1 inst931 (.enabledt(eq7), .data(inst892_q), .tridata(tag0));
  lpm_bustri2 inst936 (.enabledt(inst932_out), .data(offset), .tridata(inst936_tridata));
  not inst933 (inst933_out, inst932_out);
  lpm_bustri2 inst935 (.enabledt(inst933_out), .data(inst941_result), .tridata(inst936_tridata));
  and inst938 (inst938_out, eq7, inst937_out, inst940_out, inst939_out);
  lpm_bustri0 inst147 (.enabledt(inst152_eq3), .data(inst139_q), .tridata(data_o));
  lpm_bustri0 inst211 (.enabledt(inst217_eq2), .data(inst203_q), .tridata(data_o));
  lpm_bustri0 inst272 (.enabledt(inst279_eq1), .data(inst264_q), .tridata(data_o));
  or inst812 (inst812_out, inst888_out, c06);
  and inst1004 (inst1004_out, inst1006_out, eq7, inst1005_out, t7);
  or inst934 (inst934_out, inst932_out, inst938_out);
  lpm_dff0 inst24 (.data(data), .clock(clk), .enable(inst13_eq5), .q(dff5));
  lpm_dff0 inst140 (.data(data), .clock(clk), .enable(inst136_eq4), .q(inst140_q));
  lpm_dff0 inst265 (.data(data), .clock(clk), .enable(inst263_eq2), .q(inst265_q));
  lpm_bustri0 inst344 (.enabledt(inst380_eq0), .data(inst331_q), .tridata(data_o));
  lpm_decode0 inst782 (
    .data(inst820_tridata), .enable(inst818_out), .eq0(inst782_eq0), .eq1(inst782_eq1), .eq2(inst782_eq2),
    .eq3(inst782_eq3), .eq4(inst782_eq4), .eq5(inst782_eq5), .eq6(inst782_eq6), .eq7(inst782_eq7));
  lpm_dff0 inst204 (.data(data), .clock(clk), .enable(inst201_eq3), .q(inst204_q));
  lpm_dff0 inst337 (.data(data), .clock(clk), .enable(inst336_eq1), .q(inst337_q));
  lpm_dff0 inst659 (.data(data), .clock(clk), .enable(inst666_eq0), .q(inst659_q));
  lpm_decode0 inst798 (
    .data(inst800_tridata), .enable(inst812_out), .eq0(inst798_eq0), .eq1(inst798_eq1), .eq2(inst798_eq2),
    .eq3(inst798_eq3), .eq4(inst798_eq4), .eq5(inst798_eq5), .eq6(inst798_eq6), .eq7(inst798_eq7));
  or inst928 (inst928_out, inst1004_out, c07);
  lpm_bustri0 inst32 (.enabledt(inst35_eq5), .data(dff5), .tridata(data_o));
  lpm_decode0 inst898 (
    .data(inst936_tridata), .enable(inst934_out), .eq0(inst898_eq0), .eq1(inst898_eq1), .eq2(inst898_eq2),
    .eq3(inst898_eq3), .eq4(inst898_eq4), .eq5(inst898_eq5), .eq6(inst898_eq6), .eq7(inst898_eq7));
  lpm_dff0 inst25 (.data(data), .clock(clk), .enable(inst13_eq6), .q(dff6));
  lpm_bustri0 inst148 (.enabledt(inst152_eq4), .data(inst140_q), .tridata(data_o));
  lpm_bustri0 inst212 (.enabledt(inst217_eq3), .data(inst204_q), .tridata(data_o));
  lpm_bustri0 inst273 (.enabledt(inst279_eq2), .data(inst265_q), .tridata(data_o));
  lpm_bustri0 inst674 (.enabledt(inst682_eq0), .data(inst659_q), .tridata(data_o));
  lpm_decode0 inst914 (
    .data(inst916_tridata), .enable(inst928_out), .eq0(inst914_eq0), .eq1(inst914_eq1), .eq2(inst914_eq2),
    .eq3(inst914_eq3), .eq4(inst914_eq4), .eq5(inst914_eq5), .eq6(inst914_eq6), .eq7(inst914_eq7));
  lpm_dff0 inst141 (.data(data), .clock(clk), .enable(inst136_eq5), .q(inst141_q));
  lpm_dff0 inst266 (.data(data), .clock(clk), .enable(inst263_eq3), .q(inst266_q));
  lpm_bustri0 inst345 (.enabledt(inst380_eq1), .data(inst337_q), .tridata(data_o));
  lpm_dff0 inst667 (.data(data), .clock(clk), .enable(inst666_eq1), .q(inst667_q));
  lpm_dff0 inst205 (.data(data), .clock(clk), .enable(inst201_eq4), .q(inst205_q));
  lpm_dff0 inst338 (.data(data), .clock(clk), .enable(inst336_eq2), .q(inst338_q));
  lpm_dff0 inst775 (.data(data), .clock(clk), .enable(inst782_eq0), .q(inst775_q));
  lpm_bustri0 inst33 (.enabledt(inst35_eq6), .data(dff6), .tridata(data_o));
  lpm_bustri0 inst149 (.enabledt(inst152_eq5), .data(inst141_q), .tridata(data_o));
  lpm_dff0 inst26 (.data(data), .clock(clk), .enable(inst13_eq7), .q(dff7));
  lpm_bustri0 inst213 (.enabledt(inst217_eq4), .data(inst205_q), .tridata(data_o));
  lpm_bustri0 inst274 (.enabledt(inst279_eq3), .data(inst266_q), .tridata(data_o));
  lpm_bustri0 inst346 (.enabledt(inst380_eq2), .data(inst338_q), .tridata(data_o));
  lpm_bustri0 inst675 (.enabledt(inst682_eq1), .data(inst667_q), .tridata(data_o));
  lpm_bustri0 inst790 (.enabledt(inst798_eq0), .data(inst775_q), .tridata(data_o));
  lpm_dff0 inst891 (.data(data), .clock(clk), .enable(inst898_eq0), .q(inst891_q));
  lpm_dff0 inst142 (.data(data), .clock(clk), .enable(inst136_eq6), .q(inst142_q));
  lpm_dff0 inst206 (.data(data), .clock(clk), .enable(inst201_eq5), .q(inst206_q));
  lpm_dff0 inst267 (.data(data), .clock(clk), .enable(inst263_eq4), .q(inst267_q));
  lpm_dff0 inst668 (.data(data), .clock(clk), .enable(inst666_eq2), .q(inst668_q));
  lpm_bustri0 inst34 (.enabledt(inst35_eq7), .data(dff7), .tridata(data_o));
  lpm_dff0 inst339 (.data(data), .clock(clk), .enable(inst336_eq3), .q(inst339_q));
  lpm_dff0 inst783 (.data(data), .clock(clk), .enable(inst782_eq1), .q(inst783_q));
  lpm_bustri0 inst906 (.enabledt(inst914_eq0), .data(inst891_q), .tridata(data_o));
  lpm_bustri0 inst150 (.enabledt(inst152_eq6), .data(inst142_q), .tridata(data_o));
  lpm_bustri0 inst275 (.enabledt(inst279_eq4), .data(inst267_q), .tridata(data_o));
  lpm_bustri0 inst676 (.enabledt(inst682_eq2), .data(inst668_q), .tridata(data_o));
  lpm_dff0 inst899 (.data(data), .clock(clk), .enable(inst898_eq1), .q(inst899_q));
  not inst448 (inst448_out, k0);
  not inst418 (inst418_out, hit);
  lpm_dff0 inst143 (.data(data), .clock(clk), .enable(inst136_eq7), .q(inst143_q));
  lpm_bustri0 inst214 (.enabledt(inst217_eq5), .data(inst206_q), .tridata(data_o));
  lpm_bustri0 inst347 (.enabledt(inst380_eq3), .data(inst339_q), .tridata(data_o));
  lpm_bustri0 inst791 (.enabledt(inst798_eq1), .data(inst783_q), .tridata(data_o));
  and inst126 (w0, inst448_out, eq0, inst418_out, t0);
  lpm_dff0 inst207 (.data(data), .clock(clk), .enable(inst201_eq6), .q(inst207_q));
  lpm_dff0 inst268 (.data(data), .clock(clk), .enable(inst263_eq5), .q(inst268_q));
  lpm_dff0 inst669 (.data(data), .clock(clk), .enable(inst666_eq3), .q(inst669_q));
  lpm_dff0 inst784 (.data(data), .clock(clk), .enable(inst782_eq2), .q(inst784_q));
  lpm_bustri0 inst417 (.enabledt(w0), .data(data_o), .tridata(data));
  lpm_bustri0 inst151 (.enabledt(inst152_eq7), .data(inst143_q), .tridata(data_o));
  lpm_dff0 inst340 (.data(data), .clock(clk), .enable(inst336_eq4), .q(inst340_q));
  lpm_bustri0 inst907 (.enabledt(inst914_eq1), .data(inst899_q), .tridata(data_o));
  lpm_bustri0 inst215 (.enabledt(inst217_eq6), .data(inst207_q), .tridata(data_o));
  lpm_bustri0 inst276 (.enabledt(inst279_eq5), .data(inst268_q), .tridata(data_o));
  lpm_dff0 inst900 (.data(data), .clock(clk), .enable(inst898_eq2), .q(inst900_q));
  not inst497 (inst497_out, k1);
  not inst424 (inst424_out, hit);
  lpm_dff0 inst269 (.data(data), .clock(clk), .enable(inst263_eq6), .q(inst269_q));
  lpm_bustri0 inst348 (.enabledt(inst380_eq4), .data(inst340_q), .tridata(data_o));
  lpm_bustri0 inst677 (.enabledt(inst682_eq3), .data(inst669_q), .tridata(data_o));
  lpm_bustri0 inst792 (.enabledt(inst798_eq2), .data(inst784_q), .tridata(data_o));
  and inst187 (w1, inst497_out, eq1, inst424_out, t1);
  lpm_dff0 inst208 (.data(data), .clock(clk), .enable(inst201_eq7), .q(inst208_q));
  lpm_dff0 inst670 (.data(data), .clock(clk), .enable(inst666_eq4), .q(inst670_q));
  lpm_dff0 inst785 (.data(data), .clock(clk), .enable(inst782_eq3), .q(inst785_q));
  lpm_bustri0 inst908 (.enabledt(inst914_eq2), .data(inst900_q), .tridata(data_o));
  lpm_bustri0 inst423 (.enabledt(w1), .data(data_o), .tridata(data));
  lpm_dff0 inst341 (.data(data), .clock(clk), .enable(inst336_eq5), .q(inst341_q));
  lpm_bustri0 inst216 (.enabledt(inst217_eq7), .data(inst208_q), .tridata(data_o));
  lpm_bustri0 inst277 (.enabledt(inst279_eq6), .data(inst269_q), .tridata(data_o));
  lpm_bustri0 inst678 (.enabledt(inst682_eq4), .data(inst670_q), .tridata(data_o));
